# EAGLE board EEG_v2_8b (EAGLE 9.6.0), part 1 of 2
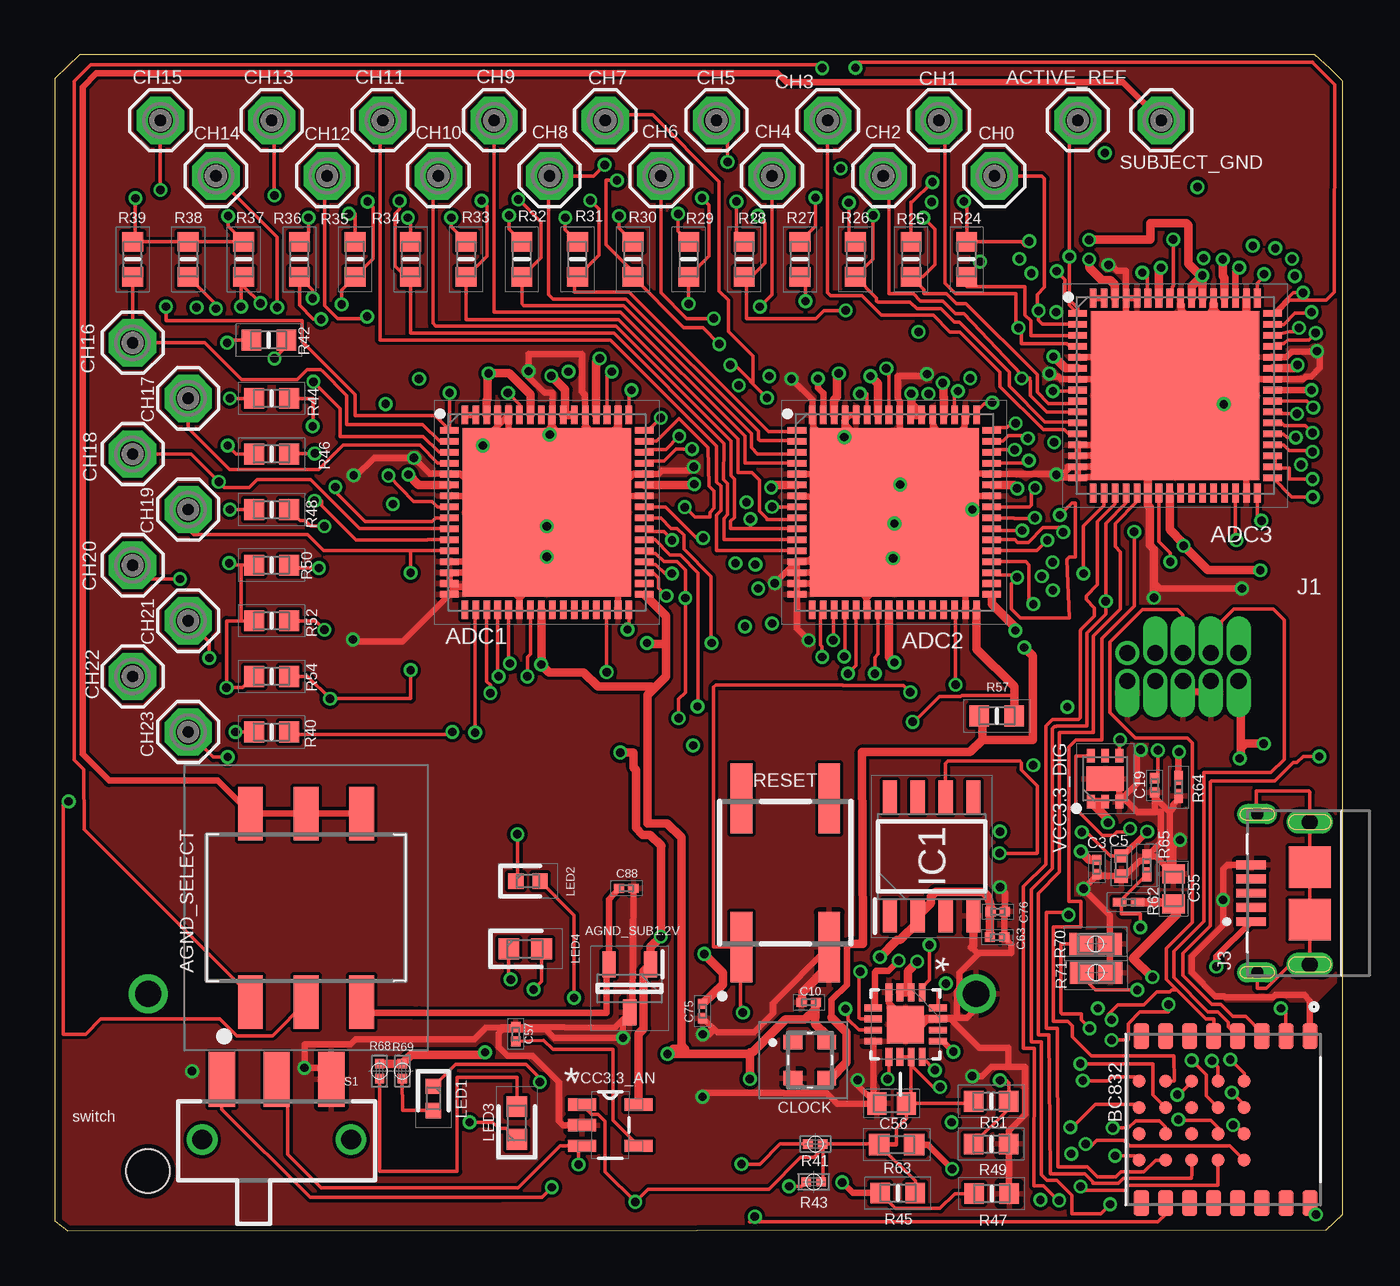
[diagram p2: board, top side]
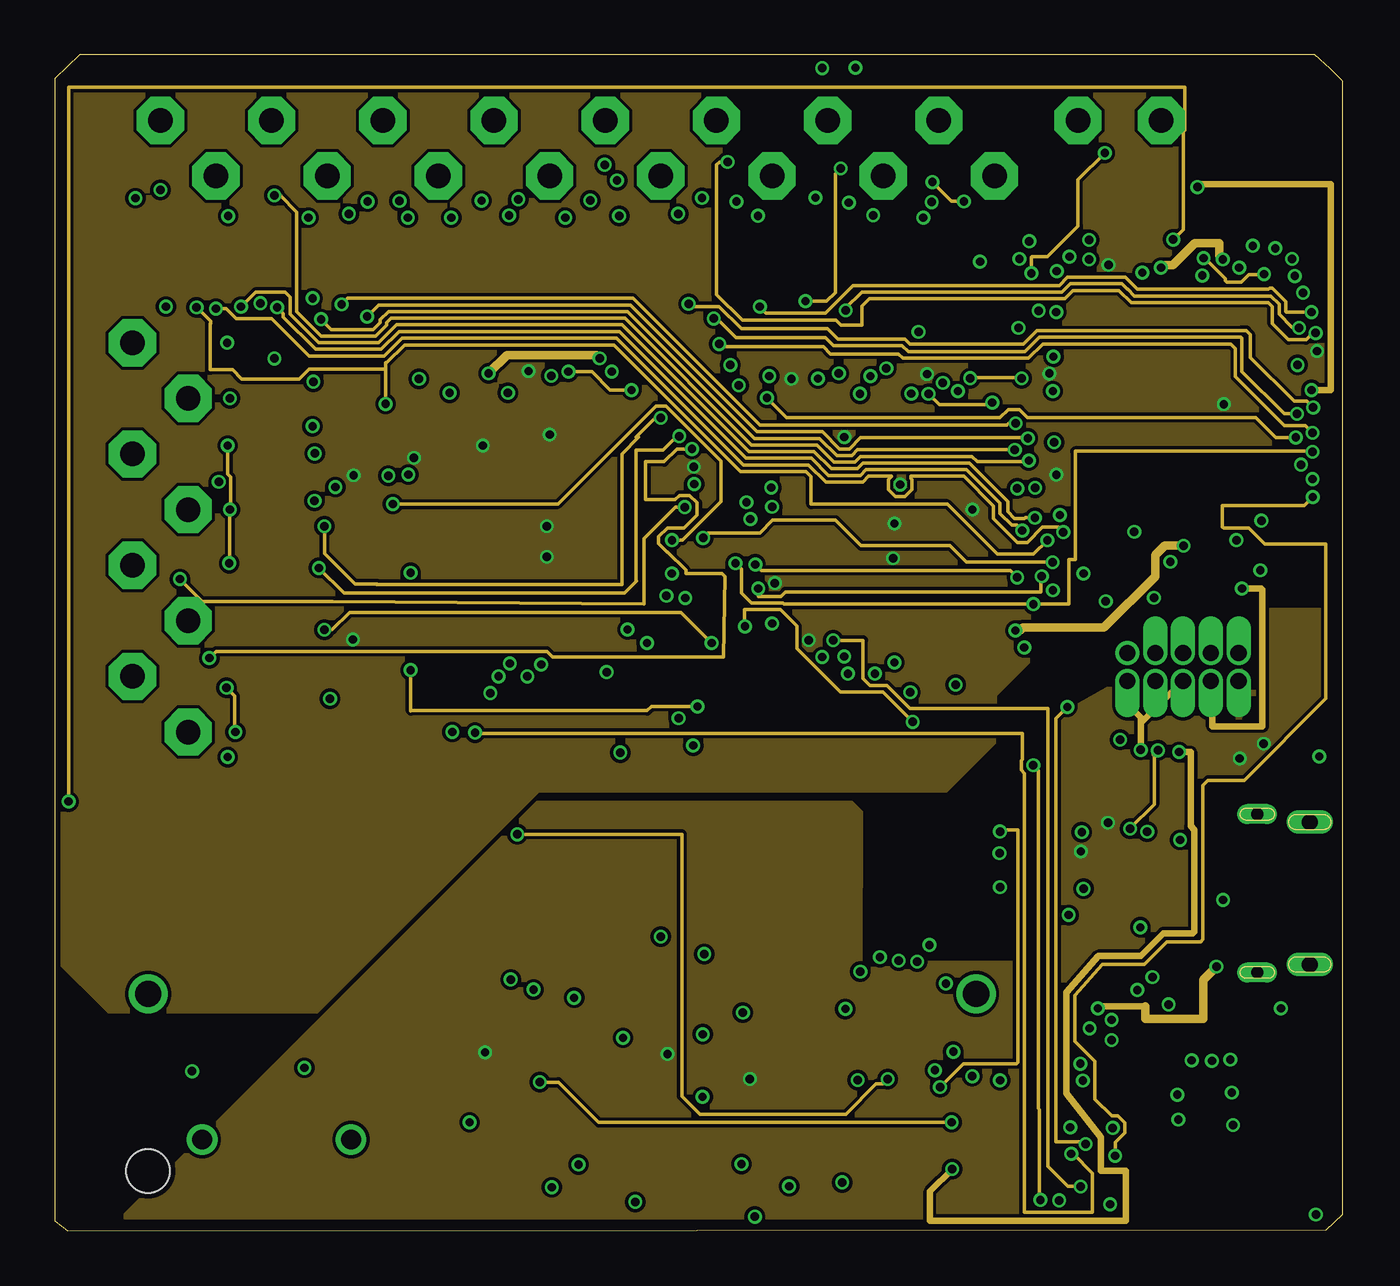
[diagram p3: board, inner layer Route2]
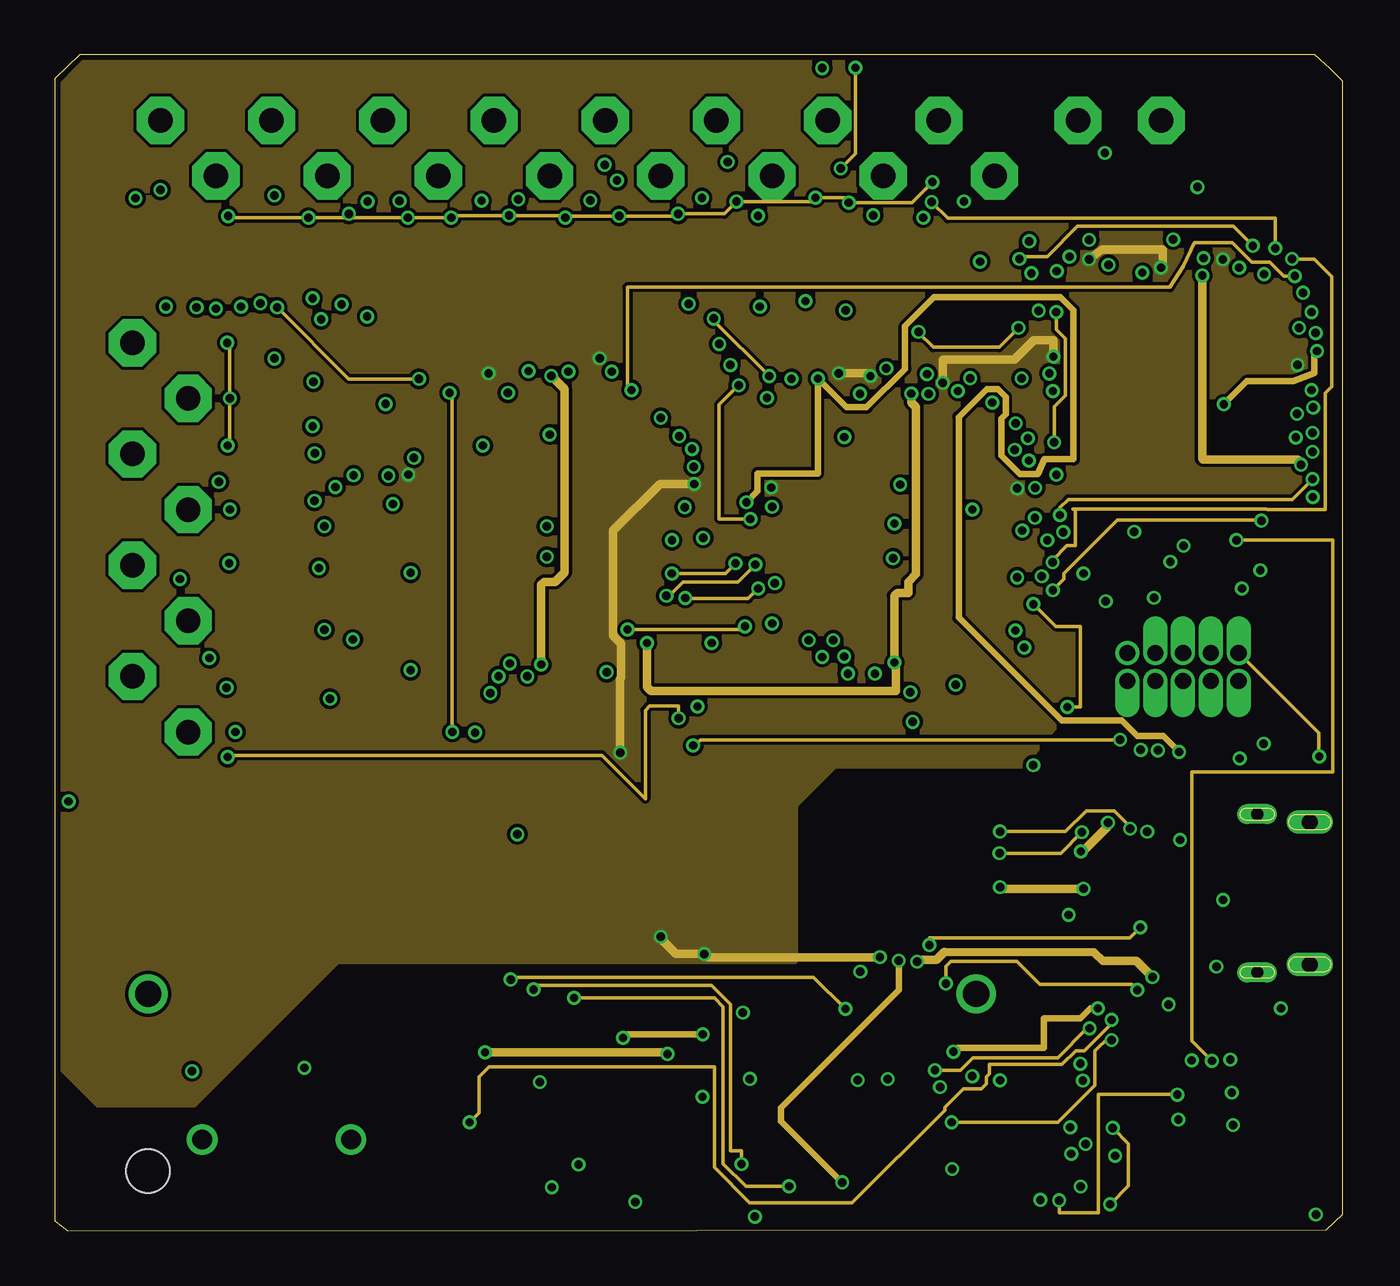
[diagram p4: board, inner layer Route15]
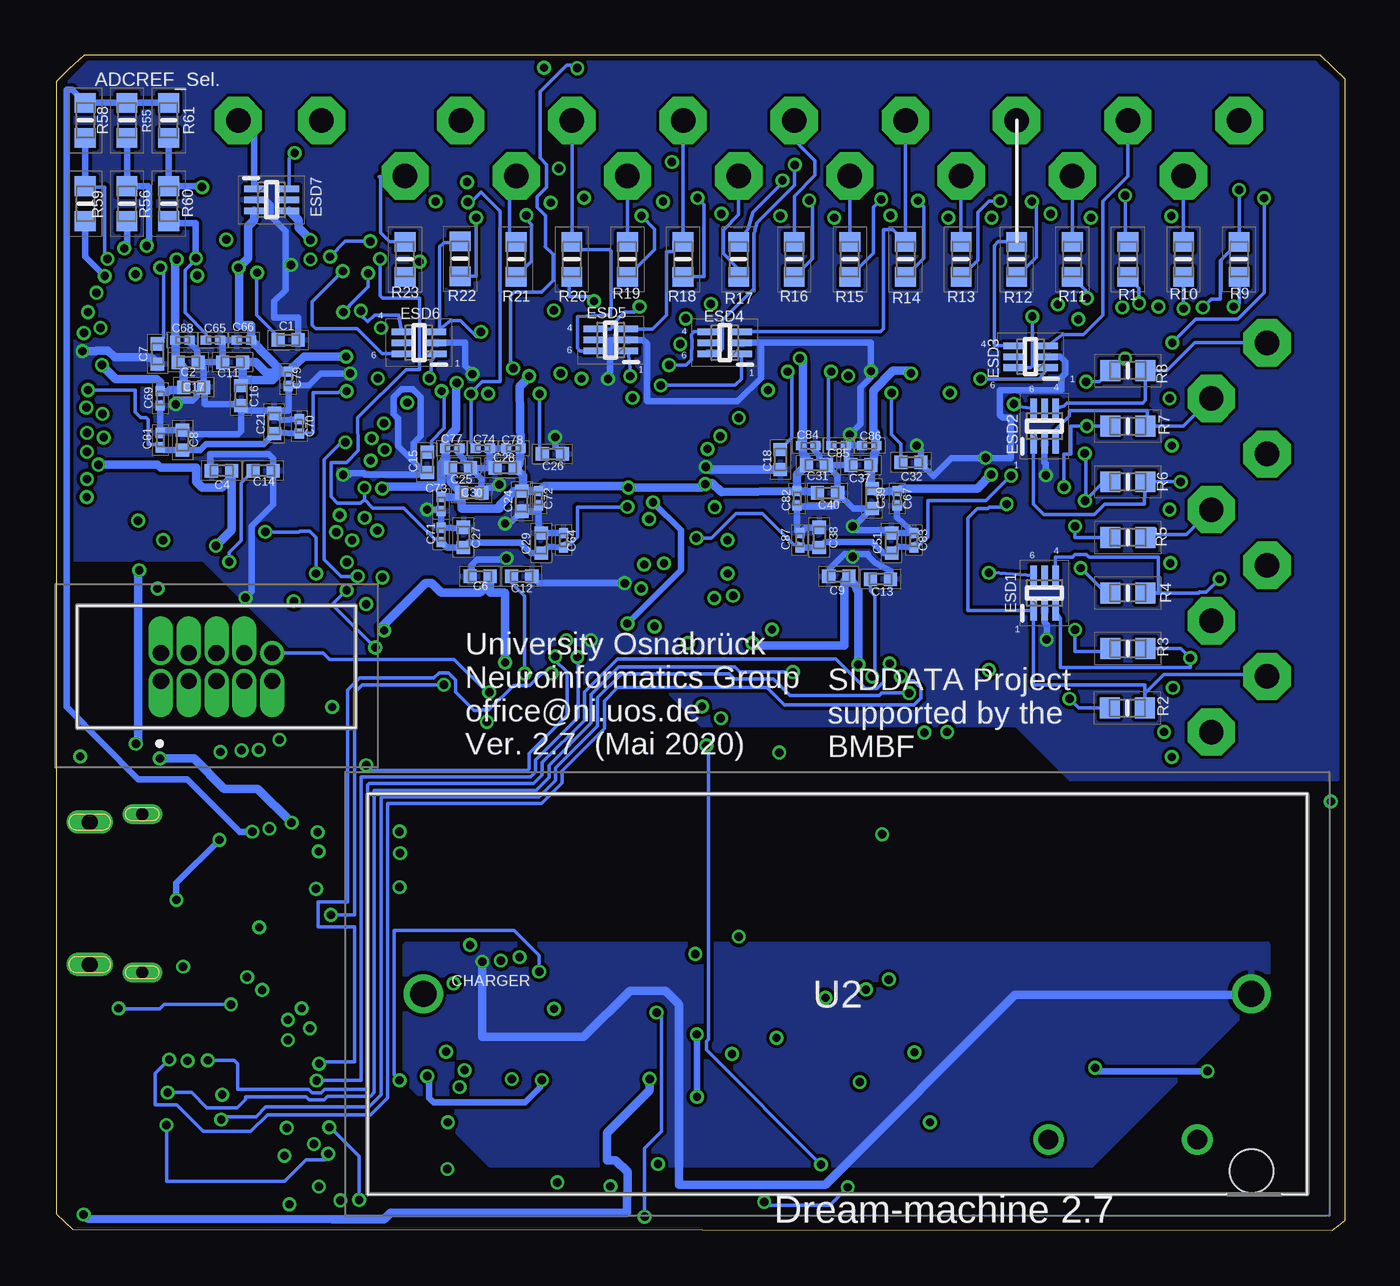
[diagram p5: board, bottom side, seen from below]

Size 58.83 x 53.72 mm. Coordinates in mm from the lower left corner, seen from the top.
Outline: 0,0.46 0.58,0 58.09,0.05 58.83,0.76 58.83,52.5 58.27,53.09 57.56,53.72 1.14,53.72 0,52.63 0,0.46
Copper layers (1+2*15+16): Top 0.018mm / dielectric 0.36mm / Route2 0.035mm / dielectric 0.71mm / Route15 0.035mm / dielectric 0.2mm / Bottom 0.018mm
Design rules "eC_4Layer_PClass6_BaseCopperO18-I35_eCDefault *": minimum track width 0.15mm, minimum drill 0.35mm, track to track 0.15mm, track to pad 0.15mm, pad to pad 0.15mm, via to via 0.15mm, smd to smd 0mil, copper to edge 0.25mm, drill to drill 0.35mm, minimum pad ring 0.175mm, minimum via ring 0.125mm, stop-mask expansion 0mil, vias tented up to drill 0.45mm, thermal gap 0.2mm
Net classes: 0 default: width 0.152 mm, drill 0.381 mm; 1 power: width 0.305 mm, drill 0.381 mm; 2 power2: width 0.381 mm, drill 0.381 mm

## Footprints (pad centres in the part's own frame; a part is rotated, then mirrored left to right if it is on the bottom)
SE11 = drill 1.118 pad 2.159 octagon: MP 0,0
QFN50P900X900X80-65N = smd 0.85 x 0.3: 1 -4.45,3.75; 2 -4.45,3.25; 3 -4.45,2.75; 4 -4.45,2.25; 5 -4.45,1.75; 6 -4.45,1.25; 7 -4.45,0.75; 8 -4.45,0.25; 9 -4.45,-0.25; 10 -4.45,-0.75; 11 -4.45,-1.25; 12 -4.45,-1.75; 13 -4.45,-2.25; 14 -4.45,-2.75; 15 -4.45,-3.25; 16 -4.45,-3.75; 33 4.45,-3.75; 34 4.45,-3.25; 35 4.45,-2.75; 36 4.45,-2.25; 37 4.45,-1.75; 38 4.45,-1.25; 39 4.45,-0.75; 40 4.45,-0.25; 41 4.45,0.25; 42 4.45,0.75; 43 4.45,1.25; 44 4.45,1.75; 45 4.45,2.25; 46 4.45,2.75; 47 4.45,3.25; 48 4.45,3.75 | smd 0.3 x 0.85: 17 -3.75,-4.45; 18 -3.25,-4.45; 19 -2.75,-4.45; 20 -2.25,-4.45; 21 -1.75,-4.45; 22 -1.25,-4.45; 23 -0.75,-4.45; 24 -0.25,-4.45; 25 0.25,-4.45; 26 0.75,-4.45; 27 1.25,-4.45; 28 1.75,-4.45; 29 2.25,-4.45; 30 2.75,-4.45; 31 3.25,-4.45; 32 3.75,-4.45; 49 3.75,4.45; 50 3.25,4.45; 51 2.75,4.45; 52 2.25,4.45; 53 1.75,4.45; 54 1.25,4.45; 55 0.75,4.45; 56 0.25,4.45; 57 -0.25,4.45; 58 -0.75,4.45; 59 -1.25,4.45; 60 -1.75,4.45; 61 -2.25,4.45; 62 -2.75,4.45; 63 -3.25,4.45; 64 -3.75,4.45 | smd 7.7 x 7.7: 65 0,0
2193LPSTR = smd 1.13 x 2.44: 1 -2.54,-4.305; 2 0,-4.305; 3 2.54,-4.305; 4 2.54,4.305; 5 0,4.305; 6 -2.54,4.305
SOT95P237X112-3N = smd 1.2 x 0.6: 1 -1.1,0.95; 2 -1.1,-0.95; 3 1.1,0
XCVR_BC832 = smd 1.19 x 0.69: 1 -3.82,3.918; 2 -3.82,2.818; 3 -3.82,1.718; 4 -3.82,0.618; 5 -3.82,-0.482; 6 -3.82,-1.582; 7 -3.82,-2.682; 8 -3.82,-3.782; 9 3.82,-3.782; 10 3.82,-2.682; 11 3.82,-1.582; 12 3.82,-0.482; 13 3.82,0.618; 14 3.82,1.718; 15 3.82,2.818; 16 3.82,3.918 | smd 0.6 x 0.6: A1 -1.75,0.919; A2 -1.75,-0.281; A3 -1.75,-1.481; A4 -1.75,-2.681; A5 -1.75,-3.881; B1 -0.55,0.919; B2 -0.55,-0.281; B3 -0.55,-1.481; B4 -0.55,-2.681; B5 -0.55,-3.881; C1 0.65,0.919; C2 0.65,-0.281; C3 0.65,-1.481; C4 0.65,-2.681; C5 0.65,-3.881; D1 1.85,0.919; D2 1.85,-0.281; D3 1.85,-1.481; D4 1.85,-2.681; D5 1.85,-3.881
CAPC1005X33N = smd 0.6 x 0.62: 1 -0.46,0; 2 0.46,0
CAPC0603X33N = smd 0.46 x 0.42: 1 -0.33,0; 2 0.33,0
CAPC1608X100N = smd 0.87 x 1.02: 1 -0.68,0; 2 0.68,0
QFN50P300X300X100-17N = smd 0.813 x 0.305: 1 -1.473,0.762; 2 -1.473,0.254; 3 -1.473,-0.254; 4 -1.473,-0.762; 9 1.473,-0.762; 10 1.473,-0.254; 11 1.473,0.254; 12 1.473,0.762 | smd 0.305 x 0.813: 5 -0.762,-1.473; 6 -0.254,-1.473; 7 0.254,-1.473; 8 0.762,-1.473; 13 0.762,1.473; 14 0.254,1.473; 15 -0.254,1.473; 16 -0.762,1.473 | smd 1.702 x 1.702: 17 0,0
DSC1001DI50081920T = smd 0.85 x 0.65: 1 -0.775,0.825; 2 -0.775,-0.825; 3 0.775,-0.825; 4 0.775,0.825
SOP50P160X60-6N = smd 0.914 x 0.3: 1 -0.798,0.5 | smd 0.904 x 0.3: 2 -0.798,0; 3 -0.798,-0.5; 4 0.798,-0.5; 5 0.798,0; 6 0.798,0.5
SOIC127P600X175-8N = smd 1.525 x 0.65: 1 -2.712,1.905; 2 -2.712,0.635; 3 -2.712,-0.635; 4 -2.712,-1.905; 5 2.712,-1.905; 6 2.712,-0.635; 7 2.712,0.635; 8 2.712,1.905
SHF10501LDTHTR = drill 0.74 pad 1.1 offset: 1 0,0; 2 0,1.27; 3 1.27,0; 4 1.27,1.27; 5 2.54,0; 6 2.54,1.27; 7 3.81,0; 8 3.81,1.27; 9 5.08,0 | drill 0.74 pad 1.1: 10 5.08,1.27
TE_2040002-1 = smd 0.4 x 1.35: 1 -1.3,2.675; 2 -0.65,2.675; 3 0,2.675; 4 0.65,2.675; 5 1.3,2.675 | smd 1.9 x 1.9: S4 -1.2,0; S5 1.2,0 | drill 0.56 long: SH1 -3.615,2.4; SH2 3.615,2.4 | drill 0.71 long: SH3 3.255,0; SH4 -3.255,0
LEDC1006X25N = smd 0.7 x 0.7: 1 -0.55,0; 2 0.55,0
LEDC1608X80N = smd 0.95 x 0.95: 1 -0.75,0; 2 0.75,0
RESC1608X55N = smd 0.9 x 0.95: 1 -0.8,0; 2 0.8,0
RESC0603X26N = smd 0.44 x 0.42: 1 -0.34,0; 2 0.34,0
RESC0603X28N = smd 0.625 x 0.4: 1 -0.412,0; 2 0.412,0
RESC1608X55N' = smd 0.95 x 1: 1 -0.8,0; 2 0.8,0
RESC1608X55N'' = smd 1.1 x 1: 1 -0.65,0; 2 0.65,0
EVQQ2 = smd 3.2 x 1: 1 -3.4,2; 2 -3.4,-2; 3 3.4,-2; 4 3.4,2
JS102011SAQN = smd 1.2 x 2.5: 1 -2.5,1; 2 0,1; 3 2.5,1 | drill 0.9 pad 1.4: 4 -3.4,-1.75; 5 3.4,-1.75
1051 = drill 1.19 pad 1.785: 1 0,0; 2 37.82,0 | hole 1.98: 0,8.1
SOT95P280X145-5N = smd 1.27 x 0.559: 1 -1.295,0.94; 2 -1.295,0; 3 -1.295,-0.94; 4 1.295,-0.94; 5 1.295,0.94
SON65P200X200X65-7N = smd 0.6 x 0.35: 1 -1.05,0.65; 2 -1.05,0; 3 -1.05,-0.65; 4 1.05,-0.65; 5 1.05,0; 6 1.05,0.65 | smd 1.1 x 1.7: 7 0,0

## Placement (x,y rotation side)
ACTIVE_REF  SE11  [SE11]  46.74,50.72 0 top
ADC1  AD7771BCPZ  [QFN50P900X900X80-65N]  22.48,32.82 0 top
ADC2  AD7771BCPZ  [QFN50P900X900X80-65N]  38.35,32.82 0 top
ADC3  AD7771BCPZ  [QFN50P900X900X80-65N]  51.18,38.15 0 top
AGND_SELECT  219-3LPSTR  [2193LPSTR]  11.48,14.76 0 top
AGND_SUB1.2V  ISL21010DFH312Z-TK  [SOT95P237X112-3N]  26.26,11.07 270 top
BC832  BC832  [XCVR_BC832]  53.42,5.08 270 top
C1  1 uF  [CAPC1005X33N]  48.26,40.69 0 bottom
C2  1 uF  [CAPC1005X33N]  52.83,39.67 180 bottom
C3  2.2uF  [CAPC0603X33N]  47.6,16.61 90 top
C4  1 uF  [CAPC1005X33N]  51.31,34.72 180 bottom
C5  1 uF  [CAPC1005X33N]  48.72,16.66 270 top
C6  1 uF  [CAPC1005X33N]  39.5,29.9 180 bottom
C7  1 uF  [CAPC1005X33N]  54.23,40.06 270 bottom
C8  1 uF  [CAPC1005X33N]  53.09,36.12 90 bottom
C9  1 uF  [CAPC1005X33N]  23.11,29.9 180 bottom
C10  0.01uF  [CAPC0603X33N]  34.44,10.44 0 top
C11  1 uF  [CAPC1005X33N]  50.8,39.67 180 bottom
C12  1 uF  [CAPC1005X33N]  37.59,29.9 180 bottom
C13  1 uF  [CAPC1005X33N]  21.21,29.77 180 bottom
C14  1 uF  [CAPC1005X33N]  49.4,34.72 0 bottom
C15  1 uF  [CAPC1005X33N]  41.91,35.1 270 bottom
C16  1 uF  [CAPC1005X33N]  50.42,38.15 90 bottom
C17  1 uF  [CAPC1005X33N]  52.58,38.53 180 bottom
C18  1 uF  [CAPC1005X33N]  25.78,35.23 270 bottom
C19  2.2uF  [CAPC0603X33N]  50.24,20.35 90 top
C21  1 uF  [CAPC1005X33N]  48.9,36.88 270 bottom
C24  1 uF  [CAPC1005X33N]  37.59,33.32 90 bottom
C25  1 uF  [CAPC1005X33N]  40.39,34.85 180 bottom
C26  1 uF  [CAPC1005X33N]  36.2,35.48 0 bottom
C27  1 uF  [CAPC1005X33N]  40.26,31.67 90 bottom
C28  1 uF  [CAPC1005X33N]  38.35,34.85 180 bottom
C29  1 uF  [CAPC1005X33N]  36.7,31.42 270 bottom
C30  1 uF  [CAPC1005X33N]  39.88,33.71 180 bottom
C31  1 uF  [CAPC1005X33N]  24.13,34.98 180 bottom
C32  1 uF  [CAPC1005X33N]  19.81,35.1 0 bottom
C37  1 uF  [CAPC1005X33N]  22.1,34.98 180 bottom
C38  1 uF  [CAPC1005X33N]  24,31.67 90 bottom
C39  1 uF  [CAPC1005X33N]  21.59,33.45 90 bottom
C40  1 uF  [CAPC1005X33N]  23.62,33.71 180 bottom
C51  1 uF  [CAPC1005X33N]  20.7,31.42 270 bottom
C55  10 uF  [CAPC1608X100N]  51.1,15.62 270 top
C56  10 uF  [CAPC1608X100N]  38.23,5.82 0 top
C57  0.01uF  [CAPC0603X33N]  21.06,8.99 90 top
C63  0.1 uF  [CAPC0603X33N]  43.05,13.41 0 top
C64  0.1 uF  [CAPC0603X33N]  35.69,31.55 270 bottom
C65  0.1 uF  [CAPC0603X33N]  51.69,40.69 180 bottom
C66  0.1 uF  [CAPC0603X33N]  50.29,40.69 180 bottom
C67  0.1 uF  [CAPC0603X33N]  20.45,33.45 90 bottom
C68  0.1 uF  [CAPC0603X33N]  53.09,40.69 180 bottom
C69  0.1 uF  [CAPC0603X33N]  54.1,38.02 90 bottom
C70  0.1 uF  [CAPC0603X33N]  47.75,36.75 270 bottom
C71  0.1 uF  [CAPC0603X33N]  41.28,31.8 90 bottom
C72  0.1 uF  [CAPC0603X33N]  36.83,33.45 90 bottom
C73  0.1 uF  [CAPC0603X33N]  41.28,33.2 90 bottom
C74  0.1 uF  [CAPC0603X33N]  39.37,35.74 180 bottom
C75  0.1 uF  [CAPC0603X33N]  29.59,10.03 90 top
C76  0.1 uF  [CAPC0603X33N]  43.08,14.58 0 top
C77  0.1 uF  [CAPC0603X33N]  40.77,35.74 180 bottom
C78  0.1 uF  [CAPC0603X33N]  37.97,35.74 180 bottom
C79  0.1 uF  [CAPC0603X33N]  48.26,38.91 90 bottom
C81  0.1 uF  [CAPC0603X33N]  54.1,36.12 90 bottom
C82  0.1 uF  [CAPC0603X33N]  25.02,33.45 90 bottom
C83  0.1 uF  [CAPC0603X33N]  19.69,31.55 270 bottom
C84  0.1 uF  [CAPC0603X33N]  24.51,35.86 180 bottom
C85  0.1 uF  [CAPC0603X33N]  23.11,35.86 180 bottom
C86  0.1 uF  [CAPC0603X33N]  21.72,35.86 180 bottom
C87  0.1 uF  [CAPC0603X33N]  24.89,31.55 90 bottom
C88  0.1 uF  [CAPC0603X33N]  26.11,15.65 180 top
CH0  SE11  [SE11]  42.93,48.18 0 top
CH1  SE11  [SE11]  40.39,50.72 0 top
CH2  SE11  [SE11]  37.85,48.18 0 top
CH3  SE11  [SE11]  35.31,50.72 0 top
CH4  SE11  [SE11]  32.77,48.18 0 top
CH5  SE11  [SE11]  30.23,50.72 0 top
CH6  SE11  [SE11]  27.69,48.18 0 top
CH7  SE11  [SE11]  25.15,50.72 0 top
CH8  SE11  [SE11]  22.61,48.18 0 top
CH9  SE11  [SE11]  20.07,50.72 0 top
CH10  SE11  [SE11]  17.53,48.18 0 top
CH11  SE11  [SE11]  14.99,50.72 0 top
CH12  SE11  [SE11]  12.45,48.18 0 top
CH13  SE11  [SE11]  9.91,50.72 0 top
CH14  SE11  [SE11]  7.37,48.18 0 top
CH15  SE11  [SE11]  4.83,50.72 0 top
CH16  SE11  [SE11]  3.56,40.56 0 top
CH17  SE11  [SE11]  6.1,38.02 0 top
CH18  SE11  [SE11]  3.56,35.48 0 top
CH19  SE11  [SE11]  6.1,32.94 0 top
CH20  SE11  [SE11]  3.56,30.4 0 top
CH21  SE11  [SE11]  6.1,27.86 0 top
CH22  SE11  [SE11]  3.56,25.32 0 top
CH23  SE11  [SE11]  6.1,22.78 0 top
CHARGER  BQ24072TRGTR  [QFN50P300X300X100-17N]  38.86,9.42 270 top
CLOCK  DSC1001DI5-008.1920T  [DSC1001DI50081920T]  34.49,7.8 0 top
ESD1  TPD4E1B06DRLR  [SOP50P160X60-6N]  13.72,29.13 90 bottom
ESD2  TPD4E1B06DRLR  [SOP50P160X60-6N]  13.72,36.75 90 bottom
ESD3  TPD4E1B06DRLR  [SOP50P160X60-6N]  14.35,39.93 180 bottom
ESD4  TPD4E1B06DRLR  [SOP50P160X60-6N]  28.32,40.56 180 bottom
ESD5  TPD4E1B06DRLR  [SOP50P160X60-6N]  33.53,40.69 180 bottom
ESD6  TPD4E1B06DRLR  [SOP50P160X60-6N]  42.29,40.56 180 bottom
ESD7  TPD4E1B06DRLR  [SOP50P160X60-6N]  49.02,47.09 0 bottom
IC1  ADR4525ARZ  [SOIC127P600X175-8N]  40.06,17.09 90 top
J1  SHF-105-01-L-D-TH-TR  [SHF10501LDTHTR]  54.08,25.12 0 bottom
J3  2040002-1  [TE_2040002-1]  57.33,15.42 90 top
LED1  SML-P11MTT86R  [LEDC1006X25N]  17.3,6.05 270 top
LED2  SML-P11MTT86R  [LEDC1006X25N]  21.62,15.98 0 top
LED3  150060RS75000  [LEDC1608X80N]  21.11,4.93 90 top
LED4  150060RS75000  [LEDC1608X80N]  21.49,12.88 0 top
R1  0 Ohm  [RESC1608X55N]  9.91,44.37 270 bottom
R2  0 Ohm  [RESC1608X55N]  9.93,23.88 180 bottom
R3  0 Ohm  [RESC1608X55N]  9.91,26.59 180 bottom
R4  0 Ohm  [RESC1608X55N]  9.91,29.13 180 bottom
R5  0 Ohm  [RESC1608X55N]  9.91,31.67 180 bottom
R6  0 Ohm  [RESC1608X55N]  9.91,34.21 180 bottom
R7  0 Ohm  [RESC1608X55N]  9.91,36.75 180 bottom
R8  0 Ohm  [RESC1608X55N]  9.91,39.29 180 bottom
R9  0 Ohm  [RESC1608X55N]  4.83,44.37 270 bottom
R10  0 Ohm  [RESC1608X55N]  7.37,44.37 270 bottom
R11  0 Ohm  [RESC1608X55N]  12.45,44.37 270 bottom
R12  0 Ohm  [RESC1608X55N]  14.99,44.37 270 bottom
R13  0 Ohm  [RESC1608X55N]  17.53,44.37 270 bottom
R14  0 Ohm  [RESC1608X55N]  20.07,44.37 270 bottom
R15  0 Ohm  [RESC1608X55N]  22.61,44.37 270 bottom
R16  0 Ohm  [RESC1608X55N]  25.15,44.37 270 bottom
R17  0 Ohm  [RESC1608X55N]  27.69,44.37 90 bottom
R18  0 Ohm  [RESC1608X55N]  30.23,44.37 270 bottom
R19  0 Ohm  [RESC1608X55N]  32.77,44.37 270 bottom
R20  0 Ohm  [RESC1608X55N]  35.31,44.37 270 bottom
R21  0 Ohm  [RESC1608X55N]  37.85,44.37 270 bottom
R22  0 Ohm  [RESC1608X55N]  40.41,44.4 270 bottom
R23  0 Ohm  [RESC1608X55N]  42.93,44.37 270 bottom
R24  0 Ohm  [RESC1608X55N]  41.66,44.37 270 top
R25  0 Ohm  [RESC1608X55N]  39.12,44.37 270 top
R26  0 Ohm  [RESC1608X55N]  36.58,44.37 270 top
R27  0 Ohm  [RESC1608X55N]  34.04,44.37 270 top
R28  0 Ohm  [RESC1608X55N]  31.5,44.37 270 top
R29  0 Ohm  [RESC1608X55N]  28.96,44.37 270 top
R30  0 Ohm  [RESC1608X55N]  26.42,44.37 270 top
R31  0 Ohm  [RESC1608X55N]  23.88,44.37 270 top
R32  0 Ohm  [RESC1608X55N]  21.34,44.37 270 top
R33  0 Ohm  [RESC1608X55N]  18.8,44.37 270 top
R34  0 Ohm  [RESC1608X55N]  16.26,44.37 270 top
R35  0 Ohm  [RESC1608X55N]  13.72,44.37 270 top
R36  0 Ohm  [RESC1608X55N]  11.18,44.37 270 top
R37  0 Ohm  [RESC1608X55N]  8.64,44.37 270 top
R38  0 Ohm  [RESC1608X55N]  6.1,44.37 270 top
R39  0 Ohm  [RESC1608X55N]  3.56,44.37 270 top
R40  0 Ohm  [RESC1608X55N]  9.91,22.78 0 top
R41  1 kohm  [RESC0603X26N]  34.75,3.96 0 top
R42  0 Ohm  [RESC1608X55N]  9.78,40.69 0 top
R43  1 kohm  [RESC0603X26N]  34.67,2.24 0 top
R44  0 Ohm  [RESC1608X55N]  9.91,38.02 0 top
R45  0 Ohm  [RESC1608X55N]  38.51,1.73 0 top
R46  0 Ohm  [RESC1608X55N]  9.91,35.48 0 top
R47  0 Ohm  [RESC1608X55N]  42.8,1.7 0 top
R48  0 Ohm  [RESC1608X55N]  9.91,32.94 0 top
R49  0 Ohm  [RESC1608X55N]  42.77,3.96 0 top
R50  0 Ohm  [RESC1608X55N]  9.91,30.4 0 top
R51  0 Ohm  [RESC1608X55N]  42.77,5.92 180 top
R52  0 Ohm  [RESC1608X55N]  9.91,27.86 0 top
R54  0 Ohm  [RESC1608X55N]  9.91,25.32 0 top
R55  0 Ohm  [RESC1608X55N]  55.63,50.72 90 bottom
R56  0 Ohm  [RESC1608X55N]  55.63,46.91 270 bottom
R57  0 Ohm  [RESC1608X55N]  43.03,23.52 0 top
R58  0 Ohm  [RESC1608X55N]  57.53,50.72 90 bottom
R59  0 Ohm  [RESC1608X55N]  57.53,46.91 270 bottom
R60  0 Ohm  [RESC1608X55N]  53.72,46.91 270 bottom
R61  0 Ohm  [RESC1608X55N]  53.72,50.72 90 bottom
R62  200kohm  [RESC0603X28N]  49.05,15.01 0 top
R63  82kOhms  [RESC1608X55N']  38.46,3.94 180 top
R64  41.2 kOhms  [RESC0603X28N]  51.33,20.27 90 top
R65  41.2 kOhms  [RESC0603X28N]  49.89,16.69 270 top
R68  1kohm  [RESC0603X26N]  14.83,7.29 90 top
R69  1 kohm  [RESC0603X26N]  15.88,7.29 90 top
R70  2.2 kOhms  [RESC1608X55N'']  47.55,13.11 180 top
R71  2.2 kOhms  [RESC1608X55N'']  47.57,11.79 180 top
RESET  EVQ-Q2B03W  [EVQQ2]  33.38,16.36 90 top
S1  JS102011SAQN  [JS102011SAQN]  10.13,5.92 0 top
SUBJECT_GND  SE11  [SE11]  50.55,50.72 0 top
U2  1051  [1051]  4.27,10.82 180 bottom
VCC3.3_AN  TPS73233DBVT  [SOT95P280X145-5N]  25.37,4.83 0 top
VCC3.3_DIG  ADP7118ACPZN3.3-R7  [SON65P200X200X65-7N]  47.98,20.65 90 top

## Tracks (layer width: path | path; a pad name or v marks a point on that pad's centre or on a via)
-CHG  (via drill 0.38)
  Top 0.152: v21.13,18.11 21.13,16.04 LED2.1 | CHARGER.9 38.1,6.98 v38.04,6.93
  Route2 0.152: v21.13,18.11 28.65,18.11 28.65,6.15 29.48,5.32 36.13,5.32 37.52,6.71 37.82,6.71 v38.04,6.93
-PGOOD  (via drill 0.38)
  Top 0.152: LED4.1 20.74,11.57 v20.83,11.48 | v36.11,10.13 36.24,10.01 36.24,9.66 36.73,9.17 CHARGER.7
  Route15 0.152: v36.11,10.13 34.67,11.58 20.93,11.58 v20.83,11.48
ADC1_IN_0+  (via drill 0.38)
  Top 0.152: ADC3.2 46.71,41.42 45.12,41.42 44.93,41.6 v44.94,42.03 44.88,42.03 44.88,42.77 45.21,43.1 45.21,48.06 45.09,48.18 CH0.MP
  Bottom 0.152: CH0.MP 44.12,48.16 44.04,48.08 44.04,45.59 43.62,45.17 R23.1 | ESD6.4 43.22,41.83 44.32,41.83 44.64,41.52 44.94,41.82 v44.94,42.03
ADC1_IN_0-  (via drill 0.38)
  Top 0.152: ACTIVE_REF.MP 46.35,50.34 v46.35,44.5 46.35,42.28 ADC3.1 46.73,42.15 46.15,42.74 46.15,43.45 v45.77,43.83 | R39.1 3.68,45.17 | 3.68,45.17 R38.1 R37.1 7.92,45.89 v7.92,46.35 | R36.1 11.59,45.59 v11.59,46.28 | R35.1 13.72,46.46 v13.44,46.46 | R34.1 16.26,46.15 v16.13,46.28 | R33.1 18.11,45.86 v18.11,46.28 | R32.1 20.75,45.76 v20.75,46.38 | v23.32,46.28 23.32,45.73 R31.1 | v25.78,46.35 25.78,45.81 R30.1 | v28.47,46.46 28.47,45.66 R29.1 | R28.1 31.14,45.53 v31.14,47.02 | v34.75,47.19 34.75,45.88 R27.1 | v36.27,46.96 36.27,45.48 R26.1 | R25.1 39.12,46.98 39.16,46.98 v40.09,47.9 | v41.53,47.02 41.55,47.02 41.66,46.91 R24.1 44.16,45.17 44.32,45.01 v44.51,45.2 | v3.68,47.17 3.68,45.17 | 8.51,27.86 7.85,27.86 v7.85,24.81 8.59,24.81 R54.1 | 8.51,27.86 R52.1 | 8.51,27.86 8.51,30.4 | 8.51,30.4 8.06,30.4 v7.97,30.5 | 8.51,30.4 R50.1 | R40.1 v8.26,22.78 | R48.1 v8,32.94 | R46.1 8.28,35.48 v7.9,35.87 | R42.1 8,40.69 v7.87,40.56 | R44.1 v8,38.02
  Route2 0.152: v40.09,47.9 40.97,47.02 v41.53,47.02 | v7.85,24.81 8.23,24.43 8.23,22.81 v8.26,22.78 | v8,32.94 8,32.82 | 8,32.82 8,30.53 v7.97,30.5 | v7.9,35.87 7.9,34.57 8.04,34.44 8.04,32.85 8,32.82
  Route15 0.152: v7.92,46.35 8,46.28 v11.59,46.28 13.26,46.28 v13.44,46.46 13.61,46.28 v16.13,46.28 v18.11,46.28 18.21,46.38 v20.75,46.38 23.22,46.38 v23.32,46.28 23.39,46.35 v25.78,46.35 28.37,46.35 v28.47,46.46 30.58,46.46 v31.14,47.02 34.57,47.02 v34.75,47.19 36.04,47.19 v36.27,46.96 39.15,46.96 v40.09,47.9 | v7.87,40.56 8,40.44 v8,38.02 8,35.97 v7.9,35.87
  Bottom 0.152: v44.51,45.2 45.65,45.2 v46.35,44.5 | v7.87,40.56 6.8,41.64 4.89,41.64 3.68,42.85 v3.68,47.17 | ESD6.6 43.98,40.06 45.12,41.21 47,41.21 47.17,41.37 47.17,42.44 v45.77,43.83
ADC1_IN_1+  (via drill 0.38)
  Top 0.152: CH1.MP 40.66,50.45 40.66,43.29 41.15,42.8 43.9,42.8 43.9,41.37 v44.02,41.24 44.15,41.12 44.15,40.53 46.22,40.53 46.35,40.4 ADC3.4
  Route15 0.152: v44.02,41.24 43.14,40.36 40.13,40.36 39.45,41.03 v39.45,41.06
  Bottom 0.152: R22.1 40.48,45.14 41.15,45.14 41.34,44.94 41.34,41.09 ESD6.3 40.85,41.58 40.39,41.58 39.66,40.85 v39.45,41.06
ADC1_IN_1-  (via drill 0.38)
  Top 0.152: ADC3.3 44.58,40.9 44.58,41.58 44.32,41.83 44.32,43.13 41.66,43.13 R24.2 42.27,44.18 v42.27,44.27
  Bottom 0.152: R23.2 42.93,43.61 v42.27,44.27
ADC1_IN_2+  (via drill 0.38)
  Top 0.152: CH2.MP 38.1,47.93 38.1,42.8 39.22,42.8 39.55,42.47 40.57,42.47 41.15,41.89 41.54,41.89 44.16,39.11 v44.16,38.94 44.54,38.94 44.5,38.9 44.57,38.84 44.57,38.16 45.33,37.4 ADC3.10
  Route2 0.152: v44.16,38.94 44.14,38.97 41.84,38.97 v41.82,38.94
  Bottom 0.152: CH2.MP 38.15,47.88 38.15,45.48 R21.1 | ESD6.1 41.73,39.69 41.73,39.02 v41.82,38.94
ADC1_IN_2-  (via drill 0.38)
  Top 0.152: ADC3.9 46.62,37.79 45.39,37.79 44.87,38.31 44.87,39.1 41.63,42.34 41.18,42.34 40.72,42.8 39.7,42.8 39.7,42.99 R25.2 39.65,43.57 40.21,44.13 40.21,45.75 v39.68,46.28
  Bottom 0.152: R22.2 39.68,43.6 v39.68,46.28
ADC1_IN_3+
  Top 0.152: ADC3.12 46.33,36.4 46.12,36.6 45.15,36.6 43.18,38.56 43.18,39.22 41.35,41.05 40.89,41.05 40.12,41.82 37.77,41.82 36.86,42.72 35.43,42.72 35.31,42.85 CH3.MP
  Bottom 0.152: CH3.MP R20.1 35.31,44.82 33.59,44.82 33.53,44.75 33.52,42.1 33.53,42.09 33.53,41.84 35.05,41.75 35.05,40.31 34.93,40.19 ESD5.6
ADC1_IN_3-  (via drill 0.38)
  Top 0.152: ADC3.11 46.68,36.95 45.23,36.95 43.61,38.58 43.61,39.22 41.32,41.51 41.09,41.51 40.48,42.12 39.37,42.12 39.07,42.42 37.59,42.42 37.54,42.47 37.54,42.61 R26.2 37.38,44.38 v37.38,46.39
  Bottom 0.152: R21.2 37.14,44.28 37.14,45.95 37.38,46.2 v37.38,46.39
ADC1_IN_4+  (via drill 0.38)
  Top 0.152: ADC3.47 56.14,41.4 56.65,41.91 57.35,41.91 v57.4,41.96 | v32.21,42.21 32.77,42.77 CH4.MP
  Route2 0.152: v57.4,41.96 56.26,41.96 56.23,41.99 56.23,42.45 55.62,43.06 55.49,43.06 55.44,43.01 49.45,43.01 48.9,43.56 46.26,43.56 45.88,43.18 36.45,43.18 35.2,41.93 32.5,41.93 v32.21,42.21
  Bottom 0.152: CH4.MP R19.1 | ESD5.4 33.54,41.19 33.48,41.25 33.48,41.38 32.89,41.96 32.46,41.96 v32.21,42.21
ADC1_IN_4-  (via drill 0.38)
  Top 0.152: R27.2 34.29,43.32 v34.29,42.47 | v57.02,42.85 56.58,42.85 ADC3.48 55.82,41.9 56.42,42.5 58.07,42.5 58.46,42.88 58.47,52.35 57.46,53.37 57.44,53.37 36.58,53.37 v36.58,53.13
  Route2 0.152: v34.29,42.47 35.26,42.47 35.65,42.85 35.65,48.28 v35.91,48.53
  Route15 0.152: v36.58,53.13 36.58,49.2 v35.91,48.53
  Bottom 0.152: v34.29,42.47 34.5,42.67 35.43,42.67 35.43,43.45 R20.2
ADC1_IN_5+  (via drill 0.38)
  Top 0.152: v30.74,48.82 30.74,50.21 CH5.MP | ADC3.45 55.76,40.52 56.15,40.52 56.32,40.69 57.28,40.69 v57.6,41.01
  Route2 0.152: v57.6,41.01 57.47,41.01 57.16,40.7 56.35,40.7 55.62,41.43 55.62,42.2 55.42,42.4 49.17,42.4 48.62,42.96 46.51,42.96 46.14,42.58 37.21,42.58 36.88,42.25 36.88,41.37 35.9,41.37 35.69,41.59 31.4,41.59 30.23,42.77 30.23,48.69 30.36,48.82 v30.74,48.82
  Bottom 0.152: CH5.MP R18.1 30.67,44.73 30.99,44.73 30.99,41.83 31.63,41.19 ESD5.3
ADC1_IN_5-  (via drill 0.38)
  Top 0.152: ADC3.46 56.39,41.07 56.66,41.07 v56.83,41.24 | v32.12,46.36 32.45,46.03 32.45,44.2 31.83,43.57 R28.2 31.59,43.48 31.59,41.67 34.77,41.67 35.14,42.04 v36.13,42.04
  Route2 0.152: v56.83,41.24 56.8,41.28 56.51,41.28 55.93,41.86 55.93,42.33 55.55,42.7 49.32,42.7 49.02,43 49,43 48.74,43.26 46.39,43.26 46.01,42.88 36.86,42.88 36.12,42.14 v36.12,42.05 v36.13,42.04
  Bottom 0.152: R19.2 31.52,44.82 31.52,45.76 v32.12,46.36
ADC1_IN_6+  (via drill 0.38)
  Top 0.152: ADC3.39 55.66,37.38 56.05,37.38 56.1,37.32 v56.74,37.32 | v30.1,41.67 28.86,41.67 27.69,42.85 CH6.MP
  Route2 0.152: v56.74,37.32 56.16,37.32 54.23,39.25 54.23,40.77 54.18,40.82 44.98,40.82 44.32,40.16 38.99,40.16 38.71,40.44 35.56,40.44 35.2,40.79 31.13,40.79 30.25,41.67 v30.1,41.67
  Route15 0.152: v32.64,39.04 30.1,41.58 v30.1,41.67
  Bottom 0.152: CH6.MP 27.69,46.42 28.39,45.72 28.39,44.63 27.69,43.93 R17.1 | ESD5.1 32.6,39.08 v32.64,39.04
ADC1_IN_6-  (via drill 0.38)
  Top 0.152: v57.48,37.61 57.19,37.9 ADC3.40 | v28.96,42.34 R29.2 29.9,44.51 29.9,46.85 v29.57,47.18
  Route2 0.152: v57.48,37.61 57.2,37.89 56.62,37.89 54.61,39.89 54.61,40.94 54.43,41.12 54.2,41.12 44.86,41.12 44.77,41.03 44.68,40.94 | v28.96,42.34 29.08,42.21 30.35,42.21 31.37,41.2 35.31,41.2 35.77,40.74 38.83,40.74 39.06,40.51 44.25,40.51 44.68,40.94 | 44.68,40.94
  Bottom 0.152: R18.2 29.26,43.57 29.26,46.87 v29.57,47.18
ADC1_IN_7+  (via drill 0.38)
  Top 0.152: ADC3.37 56.12,36.4 56.29,36.22 56.67,36.22 v56.69,36.24 | CH7.MP 25.4,50.98 27.3,50.98 30.35,47.93 30.35,42.92 30.77,42.51 30.77,41.08 31.9,39.95 31.9,38.68 v32.53,38.05 31.78,38.79 31.78,38.84 31.08,39.55 v30.86,39.55
  Route2 0.152: v56.69,36.24 v56.69,36.22 55.78,36.22 54.85,37.16 44.43,37.16 44.07,37.52 43.56,37.52 43.18,37.13 41.55,37.14 33.42,37.16 v32.53,38.05
  Bottom 0.152: CH7.MP 25.15,49.81 24.21,48.87 24.21,48.21 25.15,47.27 R16.1 | ESD4.4 29.73,41.06 29.85,40.94 29.85,40.76 29.81,40.73 29.81,40.28 29.85,40.25 29.85,39.8 30.1,39.55 v30.86,39.55
ADC1_IN_7-  (via drill 0.38)
  Top 0.152: ADC3.38 56.04,36.9 56.16,36.78 57.12,36.78 v57.46,36.45 | v30.35,40.51 29.6,41.26 28.73,41.26 R30.2 | 26.42,43.82 25.18,45.06 25.18,47.98 v25.69,47.98
  Top 0.305: 26.42,43.82 R30.2
  Route2 0.152: v57.46,36.45 57.12,36.78 56.16,36.78 53.93,39.02 53.93,40.31 53.72,40.51 45.13,40.51 44.48,39.85 38.73,39.85 38.53,40.06 35.43,40.06 35.11,40.38 30.61,40.38 30.48,40.51 v30.35,40.51
  Bottom 0.152: R17.2 27.25,45.75 27.03,46.53 25.71,47.86 25.71,47.98
  Bottom 0.305: 25.71,47.98 v25.69,47.98
ADC2_IN_0+  (via drill 0.38)
  Top 0.152: ADC2.2 33.88,36.09 32.21,36.09 32.15,36.15 32.15,36.52 26.1,42.57 22.76,42.57 22.55,42.77 22.55,48.13 CH8.MP 24.61,48.18 v25.12,48.69
  Bottom 0.152: CH8.MP R15.1 | ESD4.6 29.12,40.19 28.52,40.19 28.42,40.29 28.42,41.6 26.99,43.03 26.99,45.58 26.97,45.62 26.93,45.67 26.94,45.73 26.86,46.05 25.15,47.76 25.15,48.69 v25.12,48.69
ADC2_IN_0-  (via drill 0.38)
  Top 0.152: ADC2.1 33.84,36.5 32.6,36.5 26.23,42.87 23.75,42.87 23.75,43.45 R31.2 24.87,44.56 24.87,46.66 v24.46,47.07
  Bottom 0.152: v24.46,47.07 24.31,46.91 24.31,44.41 R16.2
ADC2_IN_1+
  Top 0.152: ADC2.4 31.52,35.07 31.52,36.29 25.85,41.96 20.07,41.96 CH9.MP
  Bottom 0.152: CH9.MP R14.1 20.63,45.74 21.08,45.74 21.08,41.2 21.22,41.06 ESD4.3
ADC2_IN_1-  (via drill 0.38)
  Top 0.152: ADC2.3 33.82,35.48 32.11,35.48 31.82,35.77 31.82,36.42 25.98,42.26 21.42,42.26 21.34,42.34 R32.2 22.23,44.46 22.23,46.07 v21.18,47.12
  Bottom 0.152: v21.18,47.12 21.53,46.76 21.53,44.65 R15.2
ADC2_IN_2+  (via drill 0.38)
  Top 0.152: ADC2.10 31.78,32.07 | 31.78,32.07 30.87,32.07 30.87,32.41 31.04,32.59 31.04,34.34 30.89,34.49 30.89,36.07 25.63,41.33 17.4,41.33 17.27,41.45 17.27,47.55 CH10.MP | v31.78,32.51 31.78,32.07
  Route15 0.152: v31.24,38.62 30.35,37.73 30.35,32.51 v31.78,32.51
  Bottom 0.152: CH10.MP R13.1 | ESD4.1 27.56,39.9 27.56,38.91 27.85,38.62 v31.24,38.62
ADC2_IN_2-  (via drill 0.38)
  Top 0.152: ADC2.9 33.83,32.49 32.54,32.49 32.54,32.53 32.19,32.88 32.19,34.3 31.84,34.65 31.22,34.65 31.22,36.17 25.76,41.63 18.8,41.63 R33.2 19.75,44.53 19.75,46.8 v19.5,47.05
  Bottom 0.152: v19.5,47.05 19.22,46.77 19.22,44.42 R14.2
ADC2_IN_3+
  Top 0.152: ADC2.12 30.23,31.07 30.23,32.7 30.43,32.89 30.43,34.01 30.23,34.21 30.23,35.84 25.39,40.69 14.86,40.69 14.86,50.6 CH11.MP
  Bottom 0.152: ESD3.4 15.99,40.43 16,40.44 16,45.01 15.84,45.17 R12.1 CH11.MP
ADC2_IN_3-  (via drill 0.38)
  Top 0.152: ADC2.11 30.56,31.57 30.56,32.54 30.73,32.71 30.73,34.14 30.56,34.31 30.56,35.97 25.54,40.99 16.26,40.99 16.26,43.36 | 16.26,43.36 R34.2 | v15.75,47.04 15.75,46.66 15.55,46.47 15.55,44.06 16.26,43.36
  Bottom 0.152: R13.2 16.76,44.34 16.76,46.53 16.26,47.04 v15.75,47.04
ADC2_IN_4+  (via drill 0.38)
  Top 0.152: v44.45,36.2 44.33,36.32 43.57,36.32 43.31,36.07 ADC2.47 | v14.27,41.76 14.03,41.76 13.94,41.67 12.91,41.67 12.32,42.27 12.32,48.06 CH12.MP
  Route2 0.152: v44.45,36.2 44.43,36.23 36.8,36.23 36.29,35.72 35.84,35.72 35.06,36.5 32.09,36.5 26.29,42.29 14.8,42.29 v14.27,41.76
  Bottom 0.152: ESD3.6 14.36,39.43 14.35,39.42 14.27,39.51 v14.27,41.76 | CH12.MP R11.1
ADC2_IN_4-  (via drill 0.38)
  Top 0.152: ADC2.48 42.93,36.69 43.5,36.69 43.69,36.88 v43.89,36.88 | v13.11,42.32 13.11,42.96 R35.2 14.55,44.4 14.55,46.76 v14.29,47.02
  Route2 0.152: v43.89,36.88 43.56,36.88 43.48,36.8 32.21,36.8 26.42,42.6 13.39,42.6 v13.11,42.32
  Bottom 0.152: R12.2 14.09,44.47 14.09,46.81 v14.29,47.02
ADC2_IN_5+  (via drill 0.38)
  Top 0.152: ADC2.45 44.38,35.07 v44.49,35.18 | v10.03,47.29 10.03,50.6 CH13.MP
  Route2 0.152: v44.49,35.18 44.41,35.18 44.36,35.13 42.13,35.13 41.9,35.37 36.8,35.37 36.54,35.11 35.59,35.11 34.81,35.89 31.84,35.89 26.04,41.69 15.37,41.69 15.16,41.48 15.16,41.36 14.67,40.87 12.17,40.87 11.05,41.99 11.05,46.53 10.29,47.29 v10.03,47.29
  Bottom 0.152: R1.1 10.03,45.3 v10.03,47.29 | CH13.MP 9.91,48.18 11.05,47.04 11.05,41.83 11.94,40.94 12.91,40.94 ESD3.3
ADC2_IN_5-  (via drill 0.38)
  Top 0.152: v43.85,35.67 42.91,35.67 ADC2.46 | v12.17,41.64 11.81,41.64 11.18,42.27 R36.2 11.78,42.97 v11.78,42.6
  Route2 0.152: v43.85,35.67 36.68,35.67 36.42,35.41 35.72,35.41 34.94,36.2 31.96,36.2 26.17,41.99 15.24,41.99 14.86,41.61 14.86,41.49 14.54,41.17 12.64,41.17 v12.17,41.64
  Bottom 0.152: R11.2 11.78,42.9 v11.78,42.6
ADC2_IN_6+  (via drill 0.38)
  Top 0.152: ADC2.39 42.88,31.99 v44.2,31.99 | v10.16,42.18 10.16,45.39 CH14.MP
  Route2 0.152: v44.2,31.99 43.96,32.23 43.72,32.23 43.18,32.77 43.18,33.23 41.64,34.77 37.05,34.77 36.79,34.51 35.34,34.51 34.56,35.29 31.58,35.29 25.79,41.08 15.74,41.08 14.92,40.26 11.92,40.26 10.44,41.74 10.44,41.9 v10.16,42.18
  Route15 0.152: v16.64,38.91 13.43,38.91 v10.16,42.18
  Bottom 0.152: CH14.MP R10.1 | ESD3.1 13.94,38.91 v16.64,38.91
ADC2_IN_6-  (via drill 0.38)
  Top 0.152: ADC2.40 43.81,32.57 43.84,32.53 44.73,32.53 v44.77,32.57 | v8.51,42.21 8.51,43.45 R37.2 8.64,43.13 v9.4,42.37
  Route2 0.152: v44.77,32.57 44.33,32.57 44.29,32.53 43.84,32.53 43.53,32.85 43.53,33.31 41.77,35.07 36.93,35.07 36.67,34.81 35.47,34.81 34.69,35.59 31.71,35.59 25.92,41.39 15.61,41.39 14.79,40.56 12.05,40.56 10.75,41.86 10.75,42.64 10.52,42.87 9.17,42.87 v8.51,42.21
  Bottom 0.152: R1.2 9.4,43.07 v9.4,42.37
ADC2_IN_7+  (via drill 0.38)
  Top 0.152: v45.34,31.54 44.87,31.07 ADC2.37 | v4.83,47.55 CH15.MP
  Route2 0.152: v45.34,31.54 44.7,30.9 43.05,30.9 40.77,33.19 34.54,33.19 34.54,34.45 34.31,34.68 31.33,34.68 25.55,40.46 15.97,40.46 15.17,39.66 15.11,39.66 15.11,39.35 | v6.48,42.18 7.11,41.55 7.11,41.45 7.1,41.44 7.1,39.33 8.12,39.33 8.53,38.91 11.17,38.91 11.61,39.35 15.11,39.35 | v15.11,37.77 15.11,39.35
  Bottom 0.152: v6.48,42.18 6.1,42.56 5.68,42.56 5.68,44.32 R9.1 v4.83,47.55 | v15.11,37.77 15.02,37.68 ESD2.6
ADC2_IN_7-  (via drill 0.38)
  Top 0.152: ADC2.38 43.85,31.57 43.97,31.45 44.47,31.45 45.14,32.12 45.86,32.12 v46.07,31.91 | v7.37,42.12 7.37,42.3 R38.2
  Route2 0.152: v46.07,31.91 45.84,32.14 45.12,32.14 44.42,31.45 43.97,31.45 42.88,32.54 42.88,33.11 41.52,34.46 39.12,34.46 39.12,34.36 39.16,34.31 39.16,33.86 38.85,33.55 38.4,33.55 38.08,33.86 38.08,34.31 38.23,34.46 37.18,34.46 36.92,34.21 35.22,34.21 34.44,34.99 31.46,34.99 25.66,40.78 15.86,40.78 15.04,39.96 11.62,39.96 9.9,41.67 8.29,41.67 7.84,42.12 v7.37,42.12
  Bottom 0.152: R10.2 v7.37,42.12
ADC3_IN_0+
  Top 0.152: ADC1.2 17.57,36.07 16.81,36.83 13.34,36.83 13.34,38.15 12.23,39.26 12.15,39.34 11.53,39.34 11.07,38.89 8.53,38.89 6.86,40.56 CH16.MP R39.2
  Bottom 0.152: CH16.MP 6.86,40.56 8.13,39.29 R8.1 9.11,37.93 9.22,37.82 12.7,37.82 12.84,37.68 ESD2.4
ADC3_IN_0-  (via drill 0.38)
  Top 0.152: v5.08,42.21 5.08,41.58 11.3,41.58 11.3,40.61 13.71,38.2 13.71,37.23 17.37,37.23 ADC1.1 v18.03,38.28 | R40.2 10.81,22.68 18.06,22.68 v18.16,22.78
  Route15 0.152: v18.16,22.78 18.16,38.28 v18.03,38.28
  Bottom 0.152: v5.08,42.21 4.95,42.21 4.83,42.34 R9.2
ADC3_IN_1+
  Top 0.152: ADC1.4 17.5,35.07 16.68,35.88 13.17,35.88 12.06,34.77 8,34.77 6.1,36.67 CH17.MP
  Bottom 0.152: R7.1 9.02,36.75 | 9.02,36.75 7.37,36.75 CH17.MP | ESD2.3 13.22,36.57 12.57,37.21 12.57,37.46 9.02,37.46 9.02,36.75
ADC3_IN_1-  (via drill 0.38)
  Top 0.152: ADC1.3 17.55,35.57 16.84,36.28 13.03,36.28 13.03,37.57 v11.81,38.79 | R42.2 10.58,40.39 v10.03,39.84
  Bottom 0.152: v11.81,38.79 11.21,38.79 R8.2 10.16,39.84 v10.03,39.84
ADC3_IN_2+  (via drill 0.38)
  Top 0.152: ADC1.10 13.93,32.07 11.68,34.32 9.25,34.32 8.89,33.96 7.75,33.96 v7.49,34.21 6.22,35.48 CH18.MP
  Bottom 0.152: v7.49,34.21 R6.1 9.14,33.2 10.97,33.2 11.44,32.72 13.75,32.72 14.22,33.19 ESD2.1
ADC3_IN_2-  (via drill 0.38)
  Top 0.152: ADC1.9 17.39,32.57 17.23,32.4 14.18,32.4 12.82,33.76 v12.82,33.97 | R44.2 11.81,38.02 11.81,36.79 v11.78,36.75
  Bottom 0.152: R7.2 v11.78,36.75 12.52,36.75 12.52,35.48 12.83,35.48 12.83,33.98 v12.82,33.97
ADC3_IN_3+  (via drill 0.38)
  Top 0.152: ADC1.12 16.26,31.07 | 16.26,31.07 12.29,31.07 11.56,31.8 6.35,31.8 6.1,32.05 CH19.MP | v16.26,30.06 16.26,31.07
  Bottom 0.152: R5.1 8.98,31.8 7.24,31.8 CH19.MP | ESD1.6 16.09,30.06 16.13,30.02 16.22,30.02 v16.26,30.06
ADC3_IN_3-  (via drill 0.38)
  Top 0.152: ADC1.11 17.04,31.57 17.02,31.55 13.77,31.55 12.2,33.12 12.2,33.34 v11.87,33.34 | v11.88,35.51 10.73,35.51 R46.2
  Bottom 0.152: R6.2 10.99,34.21 v11.87,33.34 11.83,33.38 11.83,35.46 v11.88,35.51
ADC3_IN_4+  (via drill 0.38)
  Top 0.152: ADC1.47 27.49,36.07 28.52,37.09 29.84,35.77 29.89,34.02 30.12,33.78 30.12,33.02 29.92,32.82 29.92,32.6 29.24,32.6 v28.78,33.05 | CH20.MP 4.19,29.77 v5.72,29.77
  Route2 0.152: v28.78,33.05 28.35,33.05 26.92,31.63 26.92,28.63 12.7,28.75 6.73,28.75 v5.72,29.77
  Bottom 0.152: R4.1 8.51,29.13 | 8.51,29.13 6.67,29.13 6.64,29.17 6.31,29.17 v5.72,29.77 | 13.21,30.07 13.21,30.78 12.43,30.78 12.32,30.89 11.81,30.89 11.7,30.78 8.51,30.78 8.51,29.13
  Bottom 0.305: ESD1.4 13.21,30.07
ADC3_IN_4-  (via drill 0.38)
  Top 0.152: ADC1.48 27.12,36.57 v27.69,37.13 | v12.32,32.18 11.68,32.18 11.43,32.44 11.21,32.44 R48.2
  Route2 0.152: v27.69,37.13 27.43,37.13 26.54,36.25 26.67,36.25 25.91,35.48 25.91,29.51 14.69,29.51 14.73,29.55 13.72,29.55 12.32,30.95 v12.32,32.18
  Bottom 0.152: v12.32,32.18 12.32,31.67 R5.2
ADC3_IN_5+  (via drill 0.38)
  Top 0.152: ADC1.45 27.03,35.17 27.84,35.17 28.38,35.71 v29.11,35.71 | CH21.MP 7.06,26.9 v7.06,26.16
  Route2 0.152: v7.06,26.16 7.37,26.47 22.48,26.47 22.73,26.21 30.55,26.21 30.61,29.9 30.48,30.02 28.83,30.02 28.83,30.17 28,31 27.97,31 27.58,31.39 27.58,31.7 27.99,32.11 28.75,32.11 29.34,32.7 29.34,33.25 29,33.6 28.53,33.6 28.33,33.4 26.98,33.4 26.98,35.13 27.84,35.13 28.42,35.71 v29.11,35.71
  Bottom 0.152: R3.1 7.49,26.59 v7.06,26.16 7.06,25.73 12.99,25.73 12.99,27.98 ESD1.3
ADC3_IN_5-  (via drill 0.38)
  Top 0.152: ADC1.46 27.05,35.69 27.92,35.69 v28.52,36.3 | v12.07,30.28 10.83,30.28 R50.2
  Route2 0.152: v28.52,36.3 28.42,36.3 27.79,35.66 26.54,35.66 26.54,29.69 26.58,29.68 26.04,29.13 13.21,29.13 v12.07,30.28
  Bottom 0.152: v12.07,30.28 10.92,29.13 R4.2
ADC3_IN_6+  (via drill 0.38)
  Top 0.152: v28.19,31.55 28.19,31.58 27.83,31.94 27.05,31.94 ADC1.39
  Route2 0.152: v15.44,33.2 22.98,33.2 27.46,37.68 27.91,37.68 30.43,35.16 30.43,33.3 28.68,31.55 v28.19,31.55
  Bottom 0.152: CH22.MP 3.63,25.4 8.27,25.4 9.13,24.54 R2.1 9.13,24.94 14.22,24.94 14.22,28.2 ESD1.1 17.21,28.34 17.22,28.35 17.22,32.56 16.79,33 16.31,33 16.24,33.07 15.57,33.07 v15.44,33.2
ADC3_IN_6-  (via drill 0.38)
  Top 0.152: 29.97,26.97 29.97,29.9 28.74,31.13 28.74,31.77 28.42,32.09 28.16,32.09 27.68,32.57 ADC1.40 | 29.97,26.97 | 29.97,26.97 v30.01,26.85 | v12.32,27.46 11.91,27.86 R52.2
  Route2 0.152: v30.01,26.85 28.61,28.24 13.46,28.24 12.68,27.46 v12.32,27.46
  Bottom 0.152: v12.32,27.46 12.32,26.47 10.83,26.47 R3.2
ADC3_IN_7+  (via drill 0.38)
  Top 0.152: ADC1.37 27.05,30.94 27.45,30.94 27.83,30.56 28.42,30.56 28.8,30.17 v28.8,28.9 28.8,24.59 28.5,24.28 v28.5,23.41 | v7.9,21.64 7.24,21.64 CH23.MP
  Route2 0.152: v44.61,43.74 44.61,44.47 44.64,44.5 45.34,44.5 46.74,45.9 46.74,48 v47.97,49.23 | v32.13,29.34 32.13,29.21 32.16,29.18 32.16,28.98 33.17,28.98 33.38,29.18 45.03,29.18 45.03,29.84 v45.09,29.9
  Route15 0.152: v32.13,29.34 31.67,28.88 28.83,28.88 v28.8,28.9 | v45.65,36.02 45.65,37.65 46.16,38.15 46.16,40.76 45.75,41.18 v45.75,41.96 | v28.5,23.41 28.5,23.98 27.18,23.98 26.98,23.77 26.98,19.74 24.99,21.72 7.98,21.72 v7.9,21.64
  Bottom 0.152: v45.09,29.9 45.85,29.9 46.61,30.66 46.61,35.24 45.83,36.02 v45.65,36.02 | v45.75,41.96 45.48,42.22 45.48,42.25 44.61,43.12 v44.61,43.74 | v47.97,49.23 48.22,48.98 ESD7.6
ADC3_IN_7-  (via drill 0.38)
  Top 0.152: R54.2 11.56,25.32 v12.57,24.31 16.26,24.31 v16.26,25.61 | ADC1.38 27.41,31.57 28.11,30.86 28.58,30.86 29.39,30.05 29.39,23.93 v29.36,23.95
  Route2 0.152: v29.36,23.95 27.25,23.95 27.06,23.77 16.27,23.77 16.26,23.75 v16.26,25.61
  Bottom 0.152: v12.57,24.31 12.14,23.88 R2.2
AGND-SUBJECTGROUND
  Top 0.305: C88.2 25.31,15.13 AGND_SUB1.2V.2 25.21,12.07 25.21,9.96 16.66,9.96 16.34,9.96 14.51,9.96 AGND_SELECT.3
CS_ADC1  (via drill 0.38)
  Top 0.152: ADC3.18 47.93,33.12 46.99,32.18 v46.99,30.02 | v49.31,31.93 49.31,28.53 47.83,27.05 47.83,22.43 47.81,22.42 46.65,22.42 46.33,22.1 46.33,15.04 46.86,15.04 46.86,13.89 45.62,13.89 45.62,9.57 46.28,9.57 46.48,9.37 46.48,8.86 47.36,7.98 51.11,7.98 51.13,6.85 BC832.A4
  Bottom 0.152: v49.31,31.93 47.76,31.93 47.72,31.96 47.27,31.96 46.99,31.68 v46.99,30.02
CS_ADC2  (via drill 0.38)
  Top 0.152: v35.05,26.21 35.05,26.68 34.98,26.75 34.98,28.25 ADC2.18 | v46.97,6.86 48.1,6.86 48.28,7.04 49.33,7.04 BC832.A5
  Bottom 0.152: v35.05,26.21 35.03,26.19 35.03,23.44 36.96,21.51 36.96,20.95 37.19,20.73 44.94,20.73 44.94,6.88 46.94,6.88 v46.97,6.86
CS_ADC3  (via drill 0.38)
  Top 0.152: v53.82,4.83 53.94,4.83 BC832.C1 | ADC1.18 19.2,28.34 v19.2,22.76
  Route2 0.152: v46.43,3.51 46.52,3.51 47.41,2.63 47.41,0.84 44.3,0.84 44.3,20.9 44.15,21.04 44.15,21.49 44.2,21.53 44.2,22.71 19.2,22.71 v19.2,22.76
  Bottom 0.152: v53.82,4.83 53.82,2.26 48.43,2.26 47.44,3.25 46.58,3.25 46.58,3.36 v46.43,3.51
DRDY_ADC1  (via drill 0.38)
  Top 0.152: ADC3.30 53.93,31.59 v53.98,31.55 | BC832.A2 53.14,7.48 v52.86,7.76
  Route15 0.152: v53.98,31.55 58.37,31.55 58.37,20.95 51.94,20.95 51.94,8.67 v52.86,7.76
DRDY_ADC2  (via drill 0.38)
  Top 0.152: v41.15,24.94 41.15,28.32 ADC2.30 | v46.31,14.43 46.19,14.55 45.29,14.55 45.29,9.25 45.8,9.25 45.81,2.92 47.17,2.92 47.62,2.46 48.46,2.46 48.69,2.69 49.76,2.69 50.3,3.23 BC832.D4
  Bottom 0.152: v46.31,14.43 45.24,14.43 45.24,24.59 44.88,24.94 v41.15,24.94
DRDY_ADC3  (via drill 0.38)
  Top 0.152: ADC1.30 25.2,28.34 25.2,25.88 25.21,25.87 v25.21,25.52 | BC832.B1 54.39,5.69 v53.77,6.32
  Bottom 0.152: v53.77,6.32 52.68,6.32 51.98,5.62 50.59,5.62 50.2,6.01 50.19,6.12 47.45,6.12 47.31,5.99 46.62,5.99 46.45,6.15 44.5,6.15 44.33,6.33 44.33,20.12 36.94,20.12 36.35,20.7 36.35,21.26 34.43,23.19 34.43,24.49 33.16,25.75 27.86,25.75 27.63,25.52 v25.21,25.52
GND  (via drill 0.38)
  Top 0.305: 22.68,36.72 22.73,36.76 22.73,36.77 22.73,36.76 | 21.59,31.29 v22.48,32.18 ADC1.65 24.23,34.57 ADC1.44 | 21.59,31.29 21.59,31.67 v22.48,30.78 21.59,30.78 21.59,31.29 | v19.56,35.86 19.56,36.09 20.23,36.76 20.23,36.77 | 20.23,36.77 ADC1.61 | 20.23,36.77 ADC1.60 20.73,36.6 20.83,36.5 22.47,36.5 22.61,36.64 | 22.61,36.64 22.75,36.5 23.11,36.5 23.07,36.54 22.95,36.54 22.73,36.76 | v36.07,36.26 36.06,36.25 35.12,36.25 34.65,36.72 34.65,37.22 ADC2.64 34.6,37.96 v33.66,38.91 | ADC2.60 36.32,37.27 | 36.32,37.27 ADC2.61 | v36.07,36.26 36.07,35.1 ADC2.65 | 36.07,36.88 36.07,37.01 36.32,37.27 | v36.07,36.26 36.07,36.88 | ADC2.22 37.08,28.39 37.08,28.88 | 37.08,35.86 36.07,36.88 | 37.08,33.32 37.08,35.86 | ADC2.31 41.6,31.34 37.08,35.86 | ADC1.31 25.73,29.06 25.53,29.26 21.34,29.26 | 21.34,29.26 20.85,29.26 21.23,28.88 | 18.18,29.41 ADC1.15 ADC1.14 18.84,30.07 19.3,30.53 19.27,30.57 ADC1.13 | 18.18,29.41 18.29,29.31 18.29,29.26 18.22,29.26 ADC1.16 15.89,26.92 13.56,26.92 13.56,26.96 v13.61,27.01 | ADC1.22 21.23,28.88 | 21.23,28.88 21.23,29.15 21.34,29.26 | 26.04,33.57 25.93,33.57 21.24,28.88 21.23,28.88 | 26.04,33.57 ADC1.42 | ADC2.65 35.1,29.57 | 35.1,29.57 ADC2.15 | ADC2.65 35.6,30.07 ADC2.14 | ADC2.7 33.94,33.53 35.1,33.53 35.81,32.82 37.97,32.82 | 35.41,30.57 35.05,30.92 35.05,34.57 ADC2.5 | 37.08,29.51 37.08,33.32 | 37.08,33.32 40.11,36.35 40.11,36.83 | 40.11,36.83 ADC2.53 | 37.08,28.88 41.77,33.57 | 41.77,33.57 ADC2.42 | 37.08,28.88 37.08,29.51 | 37.08,29.51 v38.29,30.72 | v38.29,30.72 38.29,31.1 41.78,34.59 42.78,34.59 ADC2.44 46.07,34.57 46.28,34.77 46.28,34.9 ADC3.15 | 36.41,29.57 37.06,28.92 37.06,28.91 37.08,28.88
  Top 0.305: 36.41,29.57 35.1,29.57 | 36.41,29.57 35.41,30.57 | 35.41,30.57 ADC2.13 ADC2.14 | ADC1.7 18.91,33.57 18.92,33.58 18.95,33.55 | 18.95,33.55 21.02,31.48 18.95,29.41 18.18,29.41 | ADC3.15 49.53,34.9 49.82,34.61 49.93,34.5 ADC3.22 49.98,33.65 49.98,31.41 50.24,31.14 50.24,29.59 50.5,29.34 v54.23,29.34 | ADC3.65 48.43,35.4 ADC3.14 ADC3.13 54.32,35.9 54.74,35.48 54.43,35.18 ADC3.31 | 48.03,39.9 48.13,39.8 48.13,38.91 48.12,38.9 ADC3.7 45.97,38.9 45.84,39.03 45.52,39.03 45.43,39.11 v45.43,39.16 | 48.03,39.9 48.01,39.93 48.9,39.93 49.02,40.06 48.93,40.15 ADC3.61 | 48.03,39.9 ADC3.5 | ADC3.65 53.98,38.15 54.74,38.91 54.75,38.9 ADC3.42 57.03,38.9 57.15,39.02 57.39,39.02 57.79,39.42 57.79,40.06 v57.66,40.18 57.64,40.17 56.51,40.17 56.25,39.9 ADC3.44 | ADC3.65 53.98,35.36 53.98,34.72 53.68,34.43 47.16,34.43 47.13,34.4 ADC3.16 | ADC3.61 48.93,41.54 49.02,41.45 51.31,41.45 51.44,41.58 | ADC3.61 48.93,41.87 48.26,41.2 51.44,41.2 | ADC3.53 52.93,42.35 52.88,42.3 52.88,42.05 52.71,41.87 | 51.44,41.2 52.03,41.2 52.71,41.87 | ADC3.61 ADC3.60 | ADC2.65 37.97,32.82 | v41.91,32.94 41.91,33.42 41.77,33.57 | v38.62,34.09 37.97,33.44 37.97,32.82 | v48.13,44.12 48.26,44.12 48.51,43.87 48.93,43.87 ADC3.61 | 50.24,19.13 C19.1 50.24,19.79 50.9,19.13 50.93,19.15 | 48.8,19.79 49.46,19.13 50.24,19.13 | 50.24,19.13 50.52,19.13 50.52,17.73 R65.1 | v39.84,39.13 39.74,39.03 38.51,39.03 38.51,38 38.6,37.9 ADC2.56 38.61,36.37 38.35,36.12 ADC2.65 | ADC1.7 18.74,33.57 18.75,33.55 18.95,33.55 | 18.76,34.34 18.76,34.47 18.9,34.61 18.95,34.57 ADC1.5 | ADC1.7 18.76,33.57 18.83,33.64 18.83,34.27 18.76,34.34
  Top 0.305: 18.76,34.34 18.5,34.6 17.12,34.6 v16.41,35.31 14.58,35.31 13.72,34.44 v13.65,34.51 | ADC2.15 ADC2.16 33.9,27.51 v34.44,26.97 | ADC2.15 ADC2.14 | C55.1 50.31,17.1 R65.1 | v38.29,30.72 34.56,30.72 34.45,30.61 33.93,30.61 v32.89,29.58 | 51.44,41.58 51.44,41.2 | 51.44,42.04 51.44,42.34 51.48,42.3 51.48,42.05 51.66,41.87 52.71,41.87 | 51.44,42.04 51.44,41.58 | 22.73,36.76 22.73,38.28 22.36,38.28 21.64,39 v21.64,39.27 21.64,40.06 24.08,40.06 24.08,38.32 24.23,38.17 24.23,38.05 ADC1.53 24.23,36.94 24.24,36.93 24.24,36.7 | ADC1.56 22.68,37.22 22.68,36.72 | 22.68,36.72 22.61,36.64 | 22.61,36.64 v22.61,36.37 | ADC3.15 ADC3.16 | ADC2.65 v38.35,32.3 | ADC1.44 26.93,34.6 26.46,34.6 26.04,34.18 26.04,33.57 | 51.44,42.04 51.43,42.04 ADC3.56 | J1.5 52.02,24.64 52.32,24.64 J1.3 | 50.93,19.15 50.93,16.48 C55.1 | v49.61,21.97 49.43,21.79 49.43,20.42 48.8,19.79 | 48.8,19.79 48.63,19.62 VCC3.3_DIG.3 48.63,20.65 VCC3.3_DIG.7 | 50.93,19.15 51.11,19.33 51.11,19.48 51.33,19.71 R64.1 | J3.5 53.55,16.72 53.37,16.54 v53.37,15.11 53.37,13.97 51.93,12.53 51.93,11.8 53.01,10.72 53.42,10.72 53.47,10.67 55.64,10.67 55.75,10.78 57.07,10.78 57.33,10.51 BC832.1 | v51.4,17.86 51.11,17.56 C55.1 | R71.1 48.2,12.11 R70.1 48.2,14.41 v46.99,15.62 47.57,16.2 47.68,16.2 | 41.89,12.95 42.14,12.7 42.24,12.7 | 42.24,12.7 43.69,12.7 43.69,13.06 C63.2 43.38,14.55 C76.2 43.41,15.47 v43.18,15.7 | RESET.2 32.81,10.39 32.81,9.94 31.93,9.06 30.28,9.06 C75.1 30.14,9.2 29.91,8.98 v29.6,8.98 | 25.96,9.67 AGND_SUB1.2V.3 26.39,10.1 C88.1 | 25.96,9.67 25.57,9.28 C57.2 19.67,9.26 19.15,8.74 13.74,8.74 13.53,8.52 11.41,8.52 v11.41,7.44 12.11,7.44 S1.3
  Top 0.305: R47.2 43.57,1.73 R49.2 43.57,4.57 44.33,5.32 44.33,6.52 44.32,6.52 44.32,7.49 43.56,7.49 | 25.96,9.67 v25.96,8.81 22.8,8.81 22.42,9.19 20.46,9.19 20.28,9.02 20.28,8.4 20.69,8 21.82,8 23.04,6.78 23.04,5.01 23.22,4.83 VCC3.3_AN.2 | 43.56,7.49 42.77,7.49 42.34,7.06 v41.91,7.06 | 38.86,9.27 CHARGER.17 38.86,9.5 | ADC2.50 41.56,37.22 41.56,36.72 41.38,36.54 40.33,36.54 40.15,36.72 40.15,36.78 40.11,36.83 | v45.75,34.54 45.89,34.4 ADC3.16 | 43.56,7.49 43.56,8.35 42.24,8.35 40.92,9.68 CHARGER.15 39.04,9.68 38.86,9.5 | 34.42,6.27 35.28,6.27 35.76,5.79 37.44,5.79 | 34.42,6.27 33.32,6.27 33.29,6.3 29.59,6.3 v29.59,6.12 | v29.19,34.9 29,34.72 27.74,34.72 27.59,34.57 ADC1.44 | CLOCK.2 34.42,6.27 | C56.1 37.52,5.79 37.44,5.79 | CHARGER.8 37.39,5.94 | 37.44,5.79 37.39,5.84 37.39,5.94 | v36.67,6.88 36.67,6.65 37.39,5.94 | CHARGER.4 38.1,10.41 38.86,9.65 38.86,9.5 | 41.2,9.73 41.68,9.73 42.09,10.14 U2.2 | 41.2,9.73 40.39,9.73 40.35,9.69 | 42.24,12.7 41.33,11.78 41.33,11.56 41.33,11.55 41.33,11.04 41.2,10.91 41.2,9.73 | R65.1 49.68,16.89 49.56,16.89 48.87,16.2 C5.2 47.68,16.2 | 47.68,16.2 C3.1
  Top 0.381: 24.24,36.7 24.44,36.5 25.52,36.5 25.72,36.7 ADC1.50 | v50.21,28.91 50.21,31.12 50.01,31.32 50.01,33.06 49.94,33.13 49.94,34.49 49.82,34.61 | ADC3.50 54.43,41.93 54.13,41.63 53.35,41.63 52.94,42.03 52.94,42.34 52.93,42.35 | RESET.2 35.38,12.12 34.16,10.9 C10.1 | 40.35,9.69 39.81,9.69 39.4,9.27 38.86,9.27 | IC1.4 41.96,13.03 41.89,12.95
  Route2 0.305: v54.23,29.34 55.12,29.34 55.17,29.29 55.17,23.04 52.88,23.04 52.88,25.04 J1.3 | J1.5 49.61,23.19 v49.61,21.97 49.61,23.44 48.97,24.08 48.97,25.09 J1.9
  Route15 0.305: v53.4,37.76 54.45,38.8 56.58,38.8 57.53,39.17 57.53,40.06 v57.66,40.18 | v25.96,8.81 26.12,8.98 v29.6,8.98
  Route15 0.381: v43.18,15.7 43.26,15.62 v46.99,15.62
  Bottom 0.305: C67.1 20.45,32.59 C83.1 19.74,31.88 C51.1 20.83,32.01 22.3,32.01 v22.48,32.18 22.4,32.18 C39.1 22.45,32.99 C40.1 | C40.1 23.16,34.47 C31.1 | C31.1 23.99,35.29 23.99,35.41 24.23,35.65 C84.1 | C38.2 24.59,32.13 C87.2 25.02,31.96 C82.1 25.02,33.09 23.4,33.09 23.16,33.33 C40.1 | C31.1 22.73,34.98 | 22.73,34.98 C37.2 | C9.2 23.5,29.97 23.5,30.28 22.86,30.91 22.48,30.91 v22.48,30.78 22.35,30.91 21.77,30.91 21.77,30.84 21.46,30.53 20.75,30.14 C13.1 | C78.2 C74.1 39.09,35.07 38.86,34.85 C28.2 C25.1 | C85.1 C86.2 | C85.1 22.61,36.09 v22.61,36.37 22.12,36.86 22.12,38.52 21.64,39 v21.64,39.27 21.64,40.56 26.67,40.56 | C26.2 36.05,35.8 36.05,35.92 36.07,35.93 v36.07,36.26 | C72.1 36.83,32.82 | 36.83,32.82 36.83,32.01 C29.1 35.74,31.88 C64.1 | 36.83,32.82 36.88,32.86 C24.1 38.15,32.3 v38.35,32.3 | C25.1 39.42,34.34 C30.1 39.16,33.96 38.73,33.96 38.62,34.07 v38.62,34.09 | C6.2 39.88,29.97 39.88,30.4 39.62,30.66 38.35,30.66 v38.29,30.72 | C25.1 40.24,35.17 40.24,35.28 40.48,35.53 C77.1 | C27.2 40.31,32.08 C71.2 C73.1 41.3,32.94 v41.91,32.94 | 49.02,37.47 50.2,37.47 C16.1 | 49.02,37.47 48.23,37.47 48.23,38.61 C79.1 47.3,38.63 46.78,39.15 45.45,39.15 v45.43,39.16 | C70.1 48.59,37.04 C21.1 49.02,37.47 | C69.1 C81.2 53.92,36.58 C8.2 52.9,36.39 50.55,36.39 50.42,36.52 C16.1 | C66.2 C65.1 51.26,40.54 C11.2 C2.1 | C68.1 52.76,40.58 52.42,40.21 52.42,39.73 C2.1 | C4.2 51.82,34.77 51.82,35.48 49.15,35.48 48.94,35.28 C14.2 48.94,33.17 49.93,32.18 49.93,29.2 v50.21,28.91 | C17.1 52.07,38.48 52.07,37.77 50.5,37.77 C16.1 | C1.2 47.8,41.71 48.9,41.71 48.9,42.47 48.39,42.98 48.39,44.37
  Bottom 0.305: v48.13,44.12 48.39,44.37 | C2.1 52.12,39.42 C17.1 | 48.39,44.37 48.39,45.67 49.07,46.35 49.07,46.87 49.29,47.09 ESD7.2 | ESD6.2 40.19,40.56 40.19,39.53 39.84,39.19 v39.84,39.13 | ESD3.2 13,39.93 12.77,39.7 12.77,39.15 12.95,38.97 12.95,38.4 15.75,38.4 15.75,37.26 15.62,37.13 15.24,37.13 15.24,35.31 v16.41,35.31 17.96,35.31 18.8,34.47 19.35,35.02 C32.2 19.35,35.66 v19.56,35.86 | v33.66,38.91 33.55,39.01 33.55,40.69 ESD5.2 32.05,40.69 31.88,40.52 31.88,37.9 27.73,37.9 26.67,38.95 26.67,40.56 | ESD4.2 26.67,40.56 | C17.1 52.44,38.21 52.44,38.1 52.61,37.92 53.32,37.92 53.4,37.83 v53.4,37.76 | C85.1 22.73,35.77 22.73,34.98 | v32.89,29.58 36.82,29.58 C12.1 | ESD1.2 13.72,28.21 13.72,27.81 13.61,27.7 v13.61,27.01 | v13.65,34.51 13.65,35.04 13.72,35.1 ESD2.2 | v11.41,7.44 11.25,7.29 v6.27,7.29 | C15.2 42.03,34.64 43.23,35.85 43.23,37.1 43.44,37.3 43.44,38.09 43.08,38.45 42.57,38.45 42.21,38.09 42.21,36.3 42.52,35.99 42.52,35.14 41.94,34.55 44.76,34.55 44.83,34.62 45.46,34.62 45.46,34.54 v45.75,34.54 | v29.6,8.98 29.59,8.96 v29.59,6.12 | v41.91,7.06 41.83,6.98 41.83,6.07 41.63,5.87 37.44,5.87 36.75,6.55 36.75,6.8 v36.67,6.88 | v51.4,17.86 53.37,15.89 v53.37,15.11
  Bottom 0.381: C7.2 54.51,39.87 54.68,39.87 54.71,39.9 56.2,39.9 56.5,40.2 57.04,40.2 57.06,40.18 v57.66,40.18 | C18.2 29.11,34.77 29.11,34.83 v29.19,34.9
  pour Top: 0.41,53.14 0.41,0.2 47.96,0.2 48.42,10.5 57.65,10.5 58.88,11.73 58.88,53.14 58.39,53.62 58.39,53.72 0.99,53.72
  pour Route2: 0.05,12.5 2.49,10.06 11.96,10.06 22.07,20.17 40.72,20.17 42.9,22.35 42.9,24.49 51.54,33.12 58.34,33.12 58.34,53.24 1.17,53.24 0.25,52.32 0.25,12.52 0.2,12.47
  pour Bottom: 0.74,52.83 0.33,52.43 0.33,20.62 12.55,20.62 15.01,23.09 29.39,23.09 31.27,24.97 46.48,24.97 52.15,30.63 58.67,30.63 58.67,52.1 57.33,53.44 1.42,53.44 1.12,53.14
GROUNDSUBJECT_OUT
  Top 0.305: SUBJECT_GND.MP 48.79,52.48 33.43,52.48 33.02,52.88 1.91,52.88 1.27,52.25 1.27,21.78 2.49,20.56 7.44,20.56 AGND_SELECT.6 AGND_SELECT.5 AGND_SELECT.4
  Bottom 0.305: SUBJECT_GND.MP 49.82,50 ESD7.1
N$1  (via drill 0.38)
  Top 0.152: ADC3.59 49.91,42.62 49.91,43.54 v49.68,43.76
  Bottom 0.152: C1.1 48.72,40.84 49.71,41.83 49.71,43.74 v49.68,43.76
N$2  (via drill 0.38)
  Top 0.152: v37.47,25.45 37.47,26.2 37.6,26.34 ADC2.23
  Bottom 0.152: C12.2 38.05,29.59 37.47,29.01 v37.47,25.45
N$3  (via drill 0.38)
  Top 0.152: v42.82,37.83 42.77,37.78 42.47,37.78 42.1,37.42 ADC2.49
  Route2 0.152: v42.82,37.83 42.73,37.74 40.4,37.74 v39.91,38.23
  Route15 0.152: v55.75,44.88 55.75,46.25 40.79,46.25 v40.06,46.99
  Bottom 0.152: C74.2 39.91,35.99 v39.91,38.22 v39.91,38.23 39.91,38.28 39.4,38.79 38.59,38.79 38.59,46.57 39.46,47.43 39.9,46.99 v40.06,46.99
  Bottom 0.305: R56.2 55.63,45.01 v55.75,44.88
N$4  (via drill 0.38)
  Top 0.152: ADC1.49 26.23,38.34
  Top 0.305: 26.23,38.34 26.18,38.38 26.18,38.4 v26.35,38.4 | v26.35,38.4
  Route2 0.152: v26.35,38.4 | v26.35,38.4 25.37,38.4 24.53,39.24 v23.47,39.24
  Route15 0.152: v56.64,43.61 56.13,43.61 55.5,44.25 54.69,44.25 53.8,45.14 52.06,45.14 51.54,44.06 50.94,43.1 26.16,43.1 26.16,38.59 v26.35,38.4
  Bottom 0.152: v23.47,39.24 23.59,39.12 23.59,36.06 C85.2
  Bottom 0.305: R59.2 57.53,44.5 v56.64,43.61
N$5  (via drill 0.38)
  Top 0.152: R49.1 43.57,5.56 R51.1 43.57,6.77 43.43,6.91 43.21,6.91 v43.18,6.87 | v36.8,11.84 36.75,11.79 36.75,9.74 36.81,9.68 CHARGER.6
  Bottom 0.152: v43.18,6.87 43.42,7.11 43.42,13.39 43.42,13.72 37.94,13.72 36.8,12.57 v36.8,11.84
N$6  (via drill 0.38)
  Top 0.152: LED1.1 18.31,7.61 21.52,7.61 22.25,6.88 v22.16,6.79 | v48.28,8.71 49.04,8.71 49.04,9.46 49.58,10 50.88,10 v50.88,10.34 | v56.01,10.16 56.23,9.93 BC832.2
  Route2 0.152: v22.16,6.79 23.01,6.79 24.84,4.95 v40.97,4.95
  Route15 0.152: v40.97,4.95 45.83,4.95 47.51,6.63 47.51,8.21 48.14,8.85 v48.28,8.71
  Bottom 0.152: v50.88,10.34 53.92,10.34 54.13,10.13 55.98,10.13 v56.01,10.16
N$7
  Top 0.305: ADC3.64 ADC3.63
N$8  (via drill 0.38)
  Top 0.305: v54.1,43.99 53.92,43.81 ADC3.51
  Bottom 0.152: v54.1,43.99 53.95,43.84 53.95,40.79 C7.1
N$9  (via drill 0.38)
  Top 0.152: S1.2 10.64,6.41 10.64,3.5 12.17,1.97 21.17,1.97 23.08,3.89 VCC3.3_AN.3 23.93,3.73 v23.93,3.02 | VCC3.3_DIG.4 48.63,22.49 48.64,22.5 48.67,22.48 v48.67,22.43
  Route15 0.152: v48.67,22.43 29.49,22.43 29.23,22.17 v29.16,22.17
  Bottom 0.152: v29.16,22.17 29.06,22.07 29.06,8.75 29.16,8.65 29.16,8.25 v23.93,3.02
N$10
  Top 0.152: R68.1 14.83,2.71 18.39,2.71 18.39,7.01 21.11,7.01 LED3.2
N$11
  Top 0.152: LED1.2 15.9,5.49 R69.1
N$12  (via drill 0.38)
  Top 0.152: LED4.2 22.24,11.39 v21.87,11.02 | v31.37,3.05 32.22,3.05 33.14,3.96 R41.1
  Route15 0.152: v21.87,11.02 22.05,11.2 30,11.2 30.86,10.34 30.86,3.66 31.37,3.66 v31.37,3.05
N$13  (via drill 0.38)
  Top 0.152: ADC2.51 41.1,38.2 v41.26,38.35
  Bottom 0.152: v41.26,38.35 41.13,38.23 41.13,36.66 41.71,36.08 41.71,35.76 C15.1
N$14  (via drill 0.38)
  Top 0.152: v50.96,30.56 50.96,30.96 50.43,31.49 ADC3.23
  Bottom 0.152: C14.1 50.42,34.17 50.42,31.53 50.96,30.99 v50.96,30.56
N$15  (via drill 0.38)
  Top 0.152: R47.1 41.11,1.7 40.43,1.03 38.41,1.03 R45.1
  Top 0.305: CHARGER.5 37.47,10.26 37.47,11.81 37.52,11.86 38.07,11.86 v38.55,12.34 | v35.97,2.21 36.45,1.73 R45.1
  Route15 0.305: v38.55,12.34 38.55,11 33.17,5.62 33.17,5 v35.97,2.21
N$16  (via drill 0.38)
  Top 0.152: v21.59,25.32 21.59,26.21 21.73,26.35 ADC1.23
  Bottom 0.152: C13.2 21.67,29.21 21.46,29.01 21.46,25.45 v21.59,25.32
N$17  (via drill 0.38)
  Top 0.152: LED2.2 23.72,14.42 v23.72,10.64 | v33.55,2.03 34.13,2.03 R43.1
  Route15 0.152: v23.72,10.64 30.13,10.64 30.53,10.24 30.53,3.06 31.56,2.03 v33.55,2.03
N$19
  Top 0.152: VCC3.3_AN.4 25.5,5.06 25.5,8.28 22.76,8.28 22.34,8.7 C57.1